# Altium project CHILD_BOARD.PrjPcb (part 1 of 2)
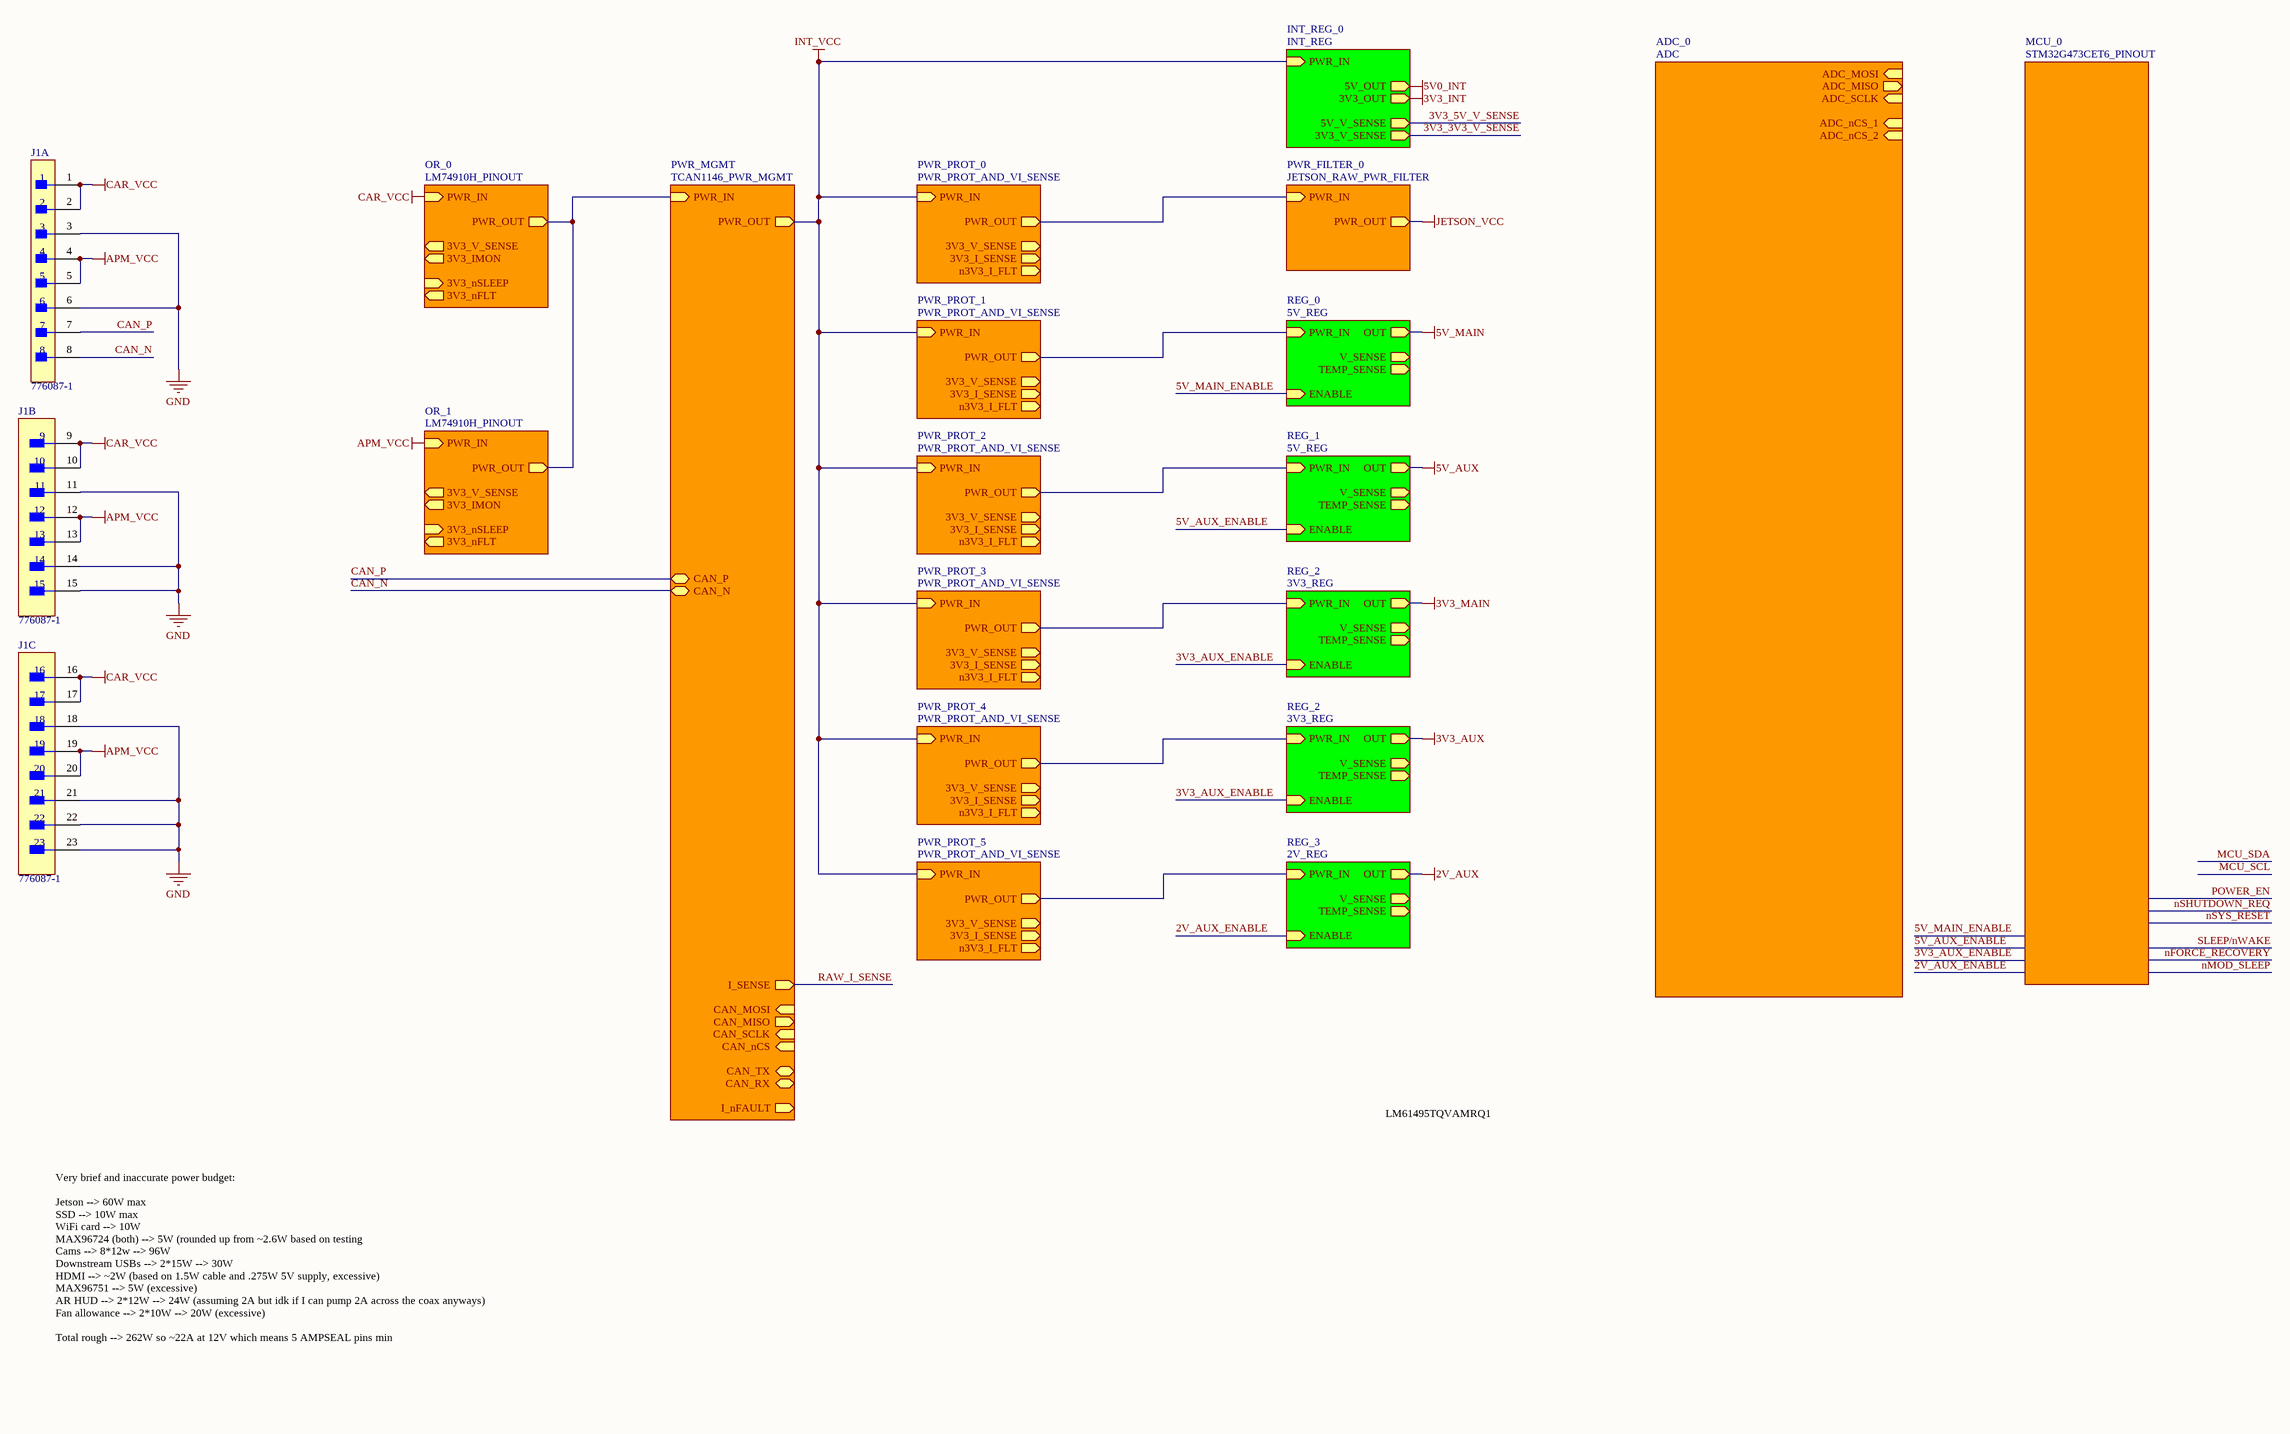
[diagram p0: CHILD_BOARD.SchDoc]
10 sheets, 204 parts. Net scope: hierarchical (ports join the sheet entries above them; power ports are global).
Board file: CHILD_BOARD_revA.PcbDoc
Sheets:
  CHILD_BOARD.SchDoc
    PWR_MGMT = TCAN1146_PWR_MGMT.SchDoc
    OR_0 = LM74910H_PINOUT.SchDoc
    OR_1 = LM74910H_PINOUT.SchDoc
    PWR_PROT_0 = PWR_PROT_AND_VI_SENSE.SchDoc
    REG_0 = 5V_REG.SchDoc
    REG_1 = 5V_REG.SchDoc
    PWR_FILTER_0 = JETSON_RAW_PWR_FILTER.SchDoc
    REG_3 = 2V_REG.SchDoc
    INT_REG_0 = INT_REG.SchDoc
    PWR_PROT_1 = PWR_PROT_AND_VI_SENSE.SchDoc
    PWR_PROT_2 = PWR_PROT_AND_VI_SENSE.SchDoc
    PWR_PROT_3 = PWR_PROT_AND_VI_SENSE.SchDoc
    PWR_PROT_4 = PWR_PROT_AND_VI_SENSE.SchDoc
    PWR_PROT_5 = PWR_PROT_AND_VI_SENSE.SchDoc
    ADC_0 = ADC.SchDoc
  PWR_MGMT.SchDoc

## Sheet CHILD_BOARD.SchDoc
size D; SheetNumber: 1; SheetTotal: 11

### Parts
J1  776087-1  [FP-776087-1-MFG]  (parts A,B,C of 3)

### Sub-sheets
ADC_0 = ADC: ADC_SCLK (in), ADC_MISO (out), ADC_MOSI (in), ADC_nCS_1 (in), ADC_nCS_2 (in)
INT_REG_0 = INT_REG: PWR_IN (in), 5V_OUT (out), 3V3_OUT (out), 5V_V_SENSE (out), 3V3_V_SENSE (out)
MCU_0 = STM32G473CET6_PINOUT (file not in this document): no entries
OR_0 = LM74910H_PINOUT: PWR_IN (in), PWR_OUT (out), 3V3_nFLT (out), 3V3_nSLEEP (in), 3V3_IMON (out), 3V3_V_SENSE (out)
OR_1 = LM74910H_PINOUT: PWR_IN (in), PWR_OUT (out), 3V3_nFLT (out), 3V3_nSLEEP (in), 3V3_IMON (out), 3V3_V_SENSE (out)
PWR_FILTER_0 = JETSON_RAW_PWR_FILTER: PWR_IN (in), PWR_OUT (out)
PWR_MGMT = TCAN1146_PWR_MGMT: PWR_IN (in), PWR_OUT (out), CAN_MOSI (in), CAN_MISO (out), CAN_SCLK (in), CAN_nCS (in), CAN_TX (bidir), CAN_RX (bidir), I_SENSE (out), I_nFAULT (out), CAN_P (bidir), CAN_N (bidir)
PWR_PROT_0 = PWR_PROT_AND_VI_SENSE: PWR_IN (in), PWR_OUT (out), 3V3_V_SENSE (out), 3V3_I_SENSE (out), n3V3_I_FLT (out)
PWR_PROT_1 = PWR_PROT_AND_VI_SENSE: PWR_IN (in), PWR_OUT (out), 3V3_V_SENSE (out), 3V3_I_SENSE (out), n3V3_I_FLT (out)
PWR_PROT_2 = PWR_PROT_AND_VI_SENSE: PWR_IN (in), PWR_OUT (out), 3V3_V_SENSE (out), 3V3_I_SENSE (out), n3V3_I_FLT (out)
PWR_PROT_3 = PWR_PROT_AND_VI_SENSE: PWR_IN (in), PWR_OUT (out), 3V3_V_SENSE (out), 3V3_I_SENSE (out), n3V3_I_FLT (out)
PWR_PROT_4 = PWR_PROT_AND_VI_SENSE: PWR_IN (in), PWR_OUT (out), 3V3_V_SENSE (out), 3V3_I_SENSE (out), n3V3_I_FLT (out)
PWR_PROT_5 = PWR_PROT_AND_VI_SENSE: PWR_IN (in), PWR_OUT (out), 3V3_V_SENSE (out), 3V3_I_SENSE (out), n3V3_I_FLT (out)
REG_0 = 5V_REG: PWR_IN (in), OUT (out), V_SENSE (out), ENABLE (in), TEMP_SENSE (out)
REG_1 = 5V_REG: OUT (out), PWR_IN (in), ENABLE (in), V_SENSE (out), TEMP_SENSE (out)
REG_2 = 3V3_REG (file not in this document): PWR_IN (in), OUT (out), V_SENSE (out), ENABLE (in), TEMP_SENSE (out)
REG_2 = 3V3_REG (file not in this document): PWR_IN (in), OUT (out), V_SENSE (out), ENABLE (in), TEMP_SENSE (out)
REG_3 = 2V_REG: PWR_IN (in), OUT (out), V_SENSE (out), ENABLE (in), TEMP_SENSE (out)

### Nets
3V3_MAIN: sheet REG_2/OUT
APM_VCC: J1.4 J1.5 J1.12 J1.13 J1.19 J1.20 ; sheet OR_1/PWR_IN
CAR_VCC: J1.1 J1.2 J1.9 J1.10 J1.16 J1.17 ; sheet OR_0/PWR_IN
GND: J1.3 J1.6 J1.11 J1.14 J1.15 J1.18 J1.21 J1.22 J1.23
INT_VCC: sheet PWR_MGMT/PWR_OUT, sheet PWR_PROT_0/PWR_IN, sheet INT_REG_0/PWR_IN, sheet PWR_PROT_1/PWR_IN, sheet PWR_PROT_2/PWR_IN, sheet PWR_PROT_3/PWR_IN, sheet PWR_PROT_4/PWR_IN, sheet PWR_PROT_5/PWR_IN  [project net PWR_OUT]
3V3_AUX_ENABLE: sheet REG_2/ENABLE, sheet REG_2/ENABLE
CAN_N: J1.8 ; sheet PWR_MGMT/CAN_N
CAN_P: J1.7 ; sheet PWR_MGMT/CAN_P
PWR_IN: sheet PWR_MGMT/PWR_IN, sheet OR_0/PWR_OUT, sheet OR_1/PWR_OUT
PWR_IN: sheet REG_0/PWR_IN, sheet PWR_PROT_1/PWR_OUT  [a separate net that carries the same name]
PWR_IN: sheet REG_1/PWR_IN, sheet PWR_PROT_2/PWR_OUT  [a separate net that carries the same name]
PWR_IN: sheet REG_3/PWR_IN, sheet PWR_PROT_5/PWR_OUT  [a separate net that carries the same name]
NetC?#1_1: sheet PWR_PROT_0/PWR_OUT, sheet PWR_FILTER_0/PWR_IN
NetR?_PWR_PROT_3#3_2: sheet REG_2/PWR_IN, sheet PWR_PROT_3/PWR_OUT
NetR?_PWR_PROT_4#3_2: sheet REG_2/PWR_IN, sheet PWR_PROT_4/PWR_OUT

### Notes on the sheet
- LM61495TQVAMRQ1
- Very brief and inaccurate power budget:
  Jetson --> 60W max
  SSD --> 10W max
  WiFi card --> 10W
  MAX96724 (both) --> 5W (rounded up from ~2.6W based on testing
  Cams --> 8*12w --> 96W
  Downstream USBs --> 2*15W --> 30W
  HDMI --> ~2W (based on 1.5W cable and .275W 5V supply, excessive)
  MAX96751 --> 5W (excessive)
  AR HUD --> 2*12W --> 24W (assuming 2A but idk if I can pump 2A across the coax anyways)
  Fan allowance --> 2*10W --> 20W (excessive)
  Total rough --> 262W so ~22A at 12V which means 5 AMPSEAL pins min

### Library data of the parts
J1 = CMP-03369-000157-2: CONN HEADER R/A 23POS 4MM; Max Voltage Rating (AC): 250V; PCB Thickness: 0.062inch; PCB Mount Alignment: Yes (With); Primary Type: Rectangular; Number of Signal Positions: 23; Row Spacing: 0.157inch; Current Rating: 17A; Connector System: Wire-to-Device; Number of Ports: 1; Shielding: Unshielded; PCB Mount Retention: With; Circuit Application: Power; Tab Thickness: 1.3mm; Gender: Male; Contact Shape: Circular; Mount: Through Hole; ELV: Compliant; Orientation: Right Angle; Lead Free: Lead Free; Contact Plating: Tin; Package Quantity: 1; RoHS Compliant: Yes; Connector Type: Header; Series: Ampseal; Termination: Solder; Voltage Rating (AC): 250V; Contact Material: Brass; Number of Rows: 3; Depth: 37.9mm; Housing Material: Polybutylene; Fastening Type: Ramp; Width: 37.9mm; Flammability Rating: UL94 V-0; Housing Color: Black; Radiation Hardening: No; Contact Type: Male Pin; Sealable: Yes (With); Length: 60.8mm; Max Operating Temperature: 221°C; Packaging: Bulk; Number of Positions: 23; Insulation Material: PBT; Pitch: 0.157inch; Contact Finish - Mating: TIN; Color: Black; Number of Terminals/Pins: 23; Insulation Color: Black; Number of Contacts: 23; Min Operating Temperature: -40°C

## Sheet TCAN1146_PWR_MGMT.SchDoc
size C; SheetNumber: 10; SheetTotal: 12
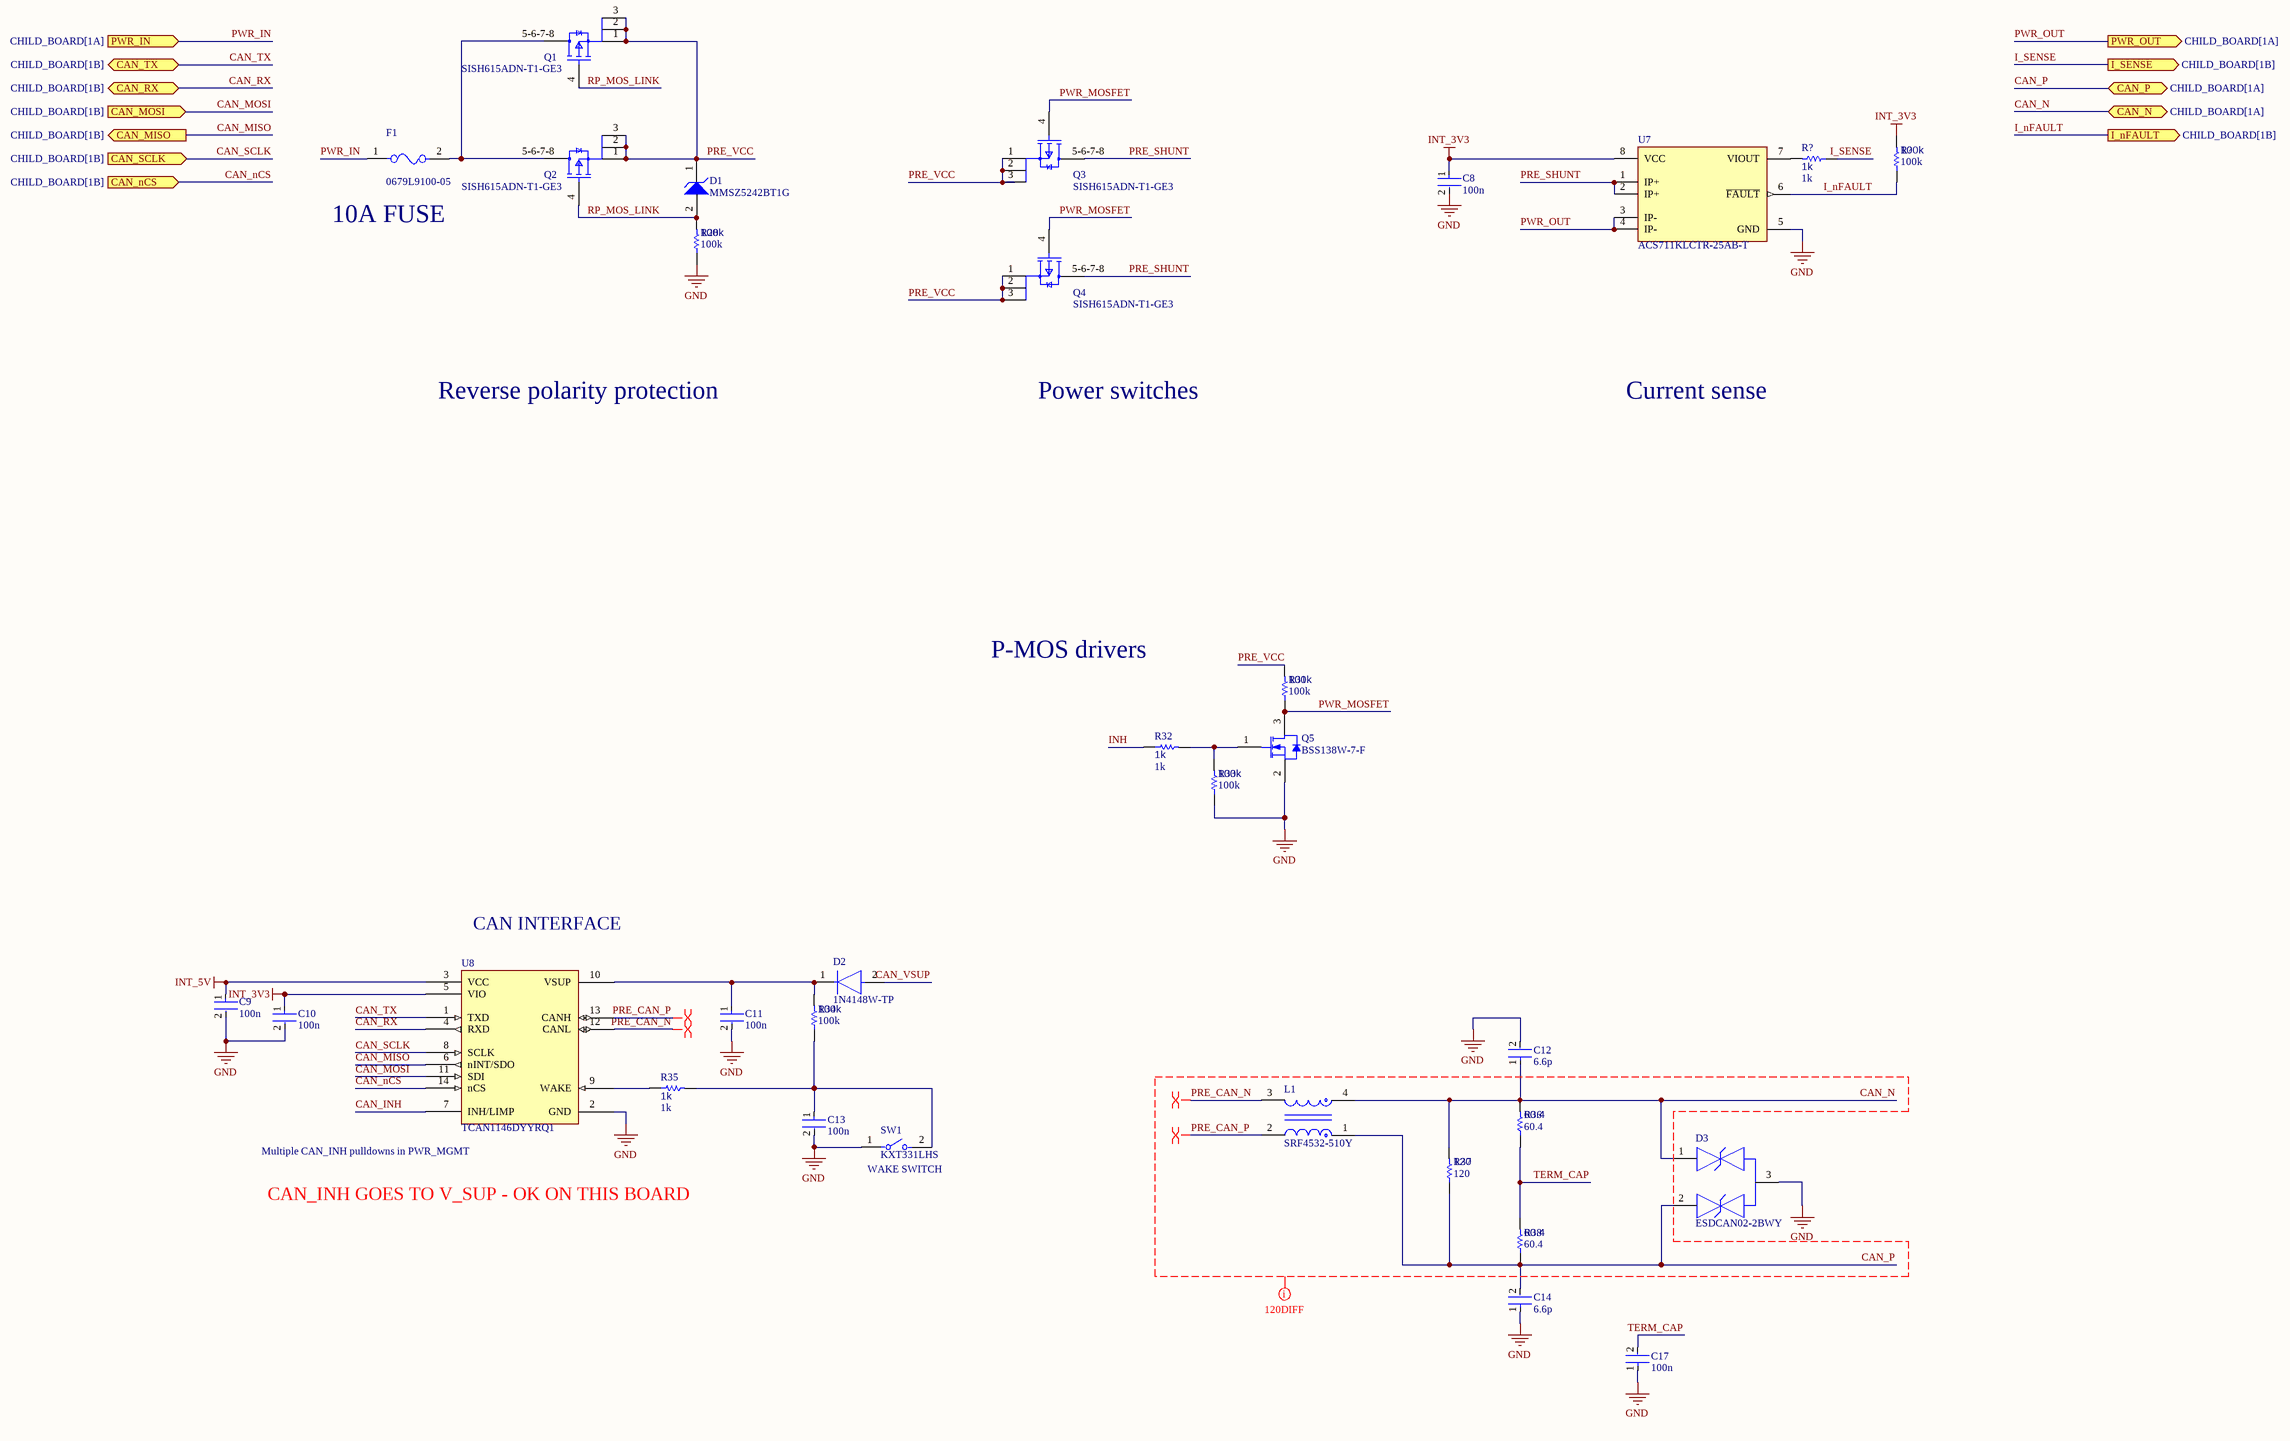
[diagram p1: TCAN1146_PWR_MGMT.SchDoc]

### Parts
(Parts that share a designator on the sheet are numbered #1, #2 ... from top to bottom, then left to right.)
C8  100n  [FP-0402-L_1_0_0_05-W_0_5-IPC_A]
C9  100n  [FP-0402-L_1_0_0_05-W_0_5-IPC_A]
C10  100n  [FP-0402-L_1_0_0_05-W_0_5-IPC_A]
C11  100n  [FP-0402-L_1_0_0_05-W_0_5-IPC_A]
C12  6.6p  [FP-0402-L_1_0_0_05-W_0_5-IPC_A]
C13  100n  [FP-0402-L_1_0_0_05-W_0_5-IPC_A]
C14  6.6p  [FP-0402-L_1_0_0_05-W_0_5-IPC_A]
C17  100n  [FP-0402-L_1_0_0_05-W_0_5-IPC_A]
D1  MMSZ5242BT1G  [ONSC-SOD-123-2-425-04_V]
D2  1N4148W-TP  [FP-SOD-123-IPC_A]
D3  ESDCAN02-2BWY  [FP-SOT323-3L-MFG]
F1  0679L9100-05  [FP-0679L-MFG]
L1  SRF4532-510Y  [FP-SRF4532-MFG]
Q1  SISH615ADN-T1-GE3  [SISH615ADN-T1-GE3-Footprint-1]
Q2  SISH615ADN-T1-GE3  [SISH615ADN-T1-GE3-Footprint-1]
Q3  SISH615ADN-T1-GE3  [SISH615ADN-T1-GE3-Footprint-1]
Q4  SISH615ADN-T1-GE3  [SISH615ADN-T1-GE3-Footprint-1]
Q5  BSS138W-7-F  [DIOD-SOT323-3_V]
R28  100k  [R0603B]
R31  100k  [R0603B]
R32  1k  [R0603B]
R33  100k  [R0603B]
R34  100k  [R0603B]
R35  1k  [R0603B]
R36  60.4  [R0603B]
R37  120  [R0603B]
R38  60.4  [R0603B]
R?#1  1k  [R0603B]
R?#2  100k  [R0603B]
SW1  KXT331LHS  [FP-KXT331LHS-MFG]
U7  ACS711KLCTR-25AB-T  [FP-LC-8-IPC_A]
U8  TCAN1146DYYRQ1  [TCAN1146DYYRQ1-Footprint-1]

### Ports
CAN_MISO (out, see CHILD_BOARD[1B]), CAN_MOSI (in, see CHILD_BOARD[1B]), CAN_N (bidir, see CHILD_BOARD[1A]), CAN_nCS (in, see CHILD_BOARD[1B]), CAN_P (bidir, see CHILD_BOARD[1A]), CAN_RX (bidir, see CHILD_BOARD[1B]), CAN_SCLK (in, see CHILD_BOARD[1B]), CAN_TX (bidir, see CHILD_BOARD[1B]), I_nFAULT (out, see CHILD_BOARD[1B]), I_SENSE (out, see CHILD_BOARD[1B]), PWR_IN (in, see CHILD_BOARD[1A]), PWR_OUT (out, see CHILD_BOARD[1A])

### Nets
GND: C8.2 C9.2 C10.2 C11.2 C12.2 C13.2 C14.1 C17.1 D3.3 Q5.2(S) R28.1 R33.1 SW1.1 U7.5(GND) U8.2(GND)
INT_3V3: C8.1 C10.1 R?#2.2 U7.8(VCC) U8.5(VIO)
INT_5V: C9.1 U8.3(VCC)
PWR_OUT: U7.3(IP-) U7.4(IP-) ; port PWR_OUT
CAN_INH: U8.7(INH/LIMP)
CAN_MISO: U8.6(nINT/SDO) ; port CAN_MISO
CAN_MOSI: U8.11(SDI) ; port CAN_MOSI
CAN_N: C12.1 D3.1 L1.4 R36.2 R37.2 ; port CAN_N
CAN_nCS: U8.14(nCS) ; port CAN_nCS
CAN_P: C14.2 D3.2 L1.1 R37.1 R38.1 ; port CAN_P
CAN_RX: U8.4(RXD) ; port CAN_RX
CAN_SCLK: U8.8(SCLK) ; port CAN_SCLK
CAN_TX: U8.1(TXD) ; port CAN_TX
CAN_VSUP: D2.2(A)
I_nFAULT: R?#2.1 U7.6(~{FAULT}) ; port I_nFAULT
I_SENSE: R?#1.1 ; port I_SENSE
INH: R32.1
PRE_CAN_N: L1.3 U8.12(CANL)
PRE_CAN_P: L1.2 U8.13(CANH)
PRE_SHUNT: Q3.5-6-7-8(D) Q4.5-6-7-8(D) U7.1(IP+) U7.2(IP+)
PRE_VCC: D1.1(K) Q1.1(S) Q1.2(S) Q1.3(S) Q2.1(S) Q2.2(S) Q2.3(S) Q3.1(S) Q3.2(S) Q3.3(S) Q4.1(S) Q4.2(S) Q4.3(S) R31.2
PWR_IN: F1.1 ; port PWR_IN
PWR_MOSFET: Q3.4(G) Q4.4(G) Q5.3(D) R31.1
RP_MOS_LINK: D1.2(A) Q1.4(G) Q2.4(G) R28.2
TERM_CAP: C17.2 R36.1 R38.2
NetC11_1: C11.1 D2.1(C) R34.2 U8.10(VSUP)
NetC13_1: C13.1 R34.1 R35.2 SW1.2
NetF1_2: F1.2 Q1.5-6-7-8(D) Q2.5-6-7-8(D)
NetQ5_1: Q5.1(G) R32.2 R33.2
NetR35_1: R35.1 U8.9(WAKE)
NetR?#1_2: R?#1.2 U7.7(VIOUT)

### Layout directives
differential pair: PRE_CAN_N, PRE_CAN_P
net class 120DIFF: CAN_N, CAN_P, PRE_CAN_N, PRE_CAN_P, TERM_CAP

### Notes on the sheet
- (near F1) 10A FUSE
- Reverse polarity protection
- Power switches
- Current sense
- P-MOS drivers
- CAN INTERFACE
- (near U8) Multiple CAN_INH pulldowns in PWR_MGMT
- (near SW1) WAKE SWITCH
- CAN_INH GOES TO V_SUP - OK ON THIS BOARD

### Library data of the parts
C8-C14 C17 = CMP-001-00058-1: LARGE PADS, 0402 CAP, CHANGE COMMENT TO MATCH REAL P/N; Capacitor Type: Ceramic; Min Operating Temperature: -55°C; Mounting Technology: Surface Mount; Pins: 2; Case/Package: 0402; RoHS Compliant: Yes; Max Operating Temperature: 85°C
D1 = CMP-1060-00565-1: Zener Voltage Regulator, 500 mW, 2-Pin SOD-123, Pb-Free, Tape and Reel; Manufacturer: On Semiconductor; P Max (W): 0.5; VZ Typ (V): 12; PartNumber: MMSZ5242BT1G; PackageReference: SOD-123-2-425-04; ComponentLink3URL: http://www.onsemi.com/pub_link/Collateral/425-04.PDF; Mounting Technology: Surface Mount; ComponentLink2Description: Datasheet; ComponentLink1URL: http://www.onsemi.com/; ComponentLink3Description: Package Specification; PackageDescription: 2-Pin SOD, Body 1.6 x 2.69 mm; PackageVersion: Rev. G, 10/2009; ComponentLink1Description: Manufacturer URL; RoHS: Pb-Free; ComponentLink2URL: http://www.onsemi.com/pub_link/Collateral/MMSZ5221BT1-D.PDF; Packing: Tape and Reel; DatasheetVersion: Rev. 12
D2 = CMP-2000-04993-2: DIODE GEN PURP 100V 150MA SOD123; Max Reverse Leakage Current: 5uA; Max Surge Current: 2A; Reverse Recovery Time: 4ns; Polarity: Standard; Capacitance: 4pF; Max Forward Surge Current (Ifsm): 1A; Element Configuration: Single; Power Dissipation: 400mW; Forward Voltage: 1V; Radiation Hardening: No; Lead Free: Lead Free; Max Reverse Voltage (DC): 100V; Current Rating: 150mA; Forward Current: 150mA; Packaging: Tape and Reel; Number of Pins: 2; Package Quantity: 3000; Max Operating Temperature: 150°C; Min Operating Temperature: -65°C; Average Rectified Current: 150mA; Recovery Time: 4ns; Output Current: 150mA; Peak Non-Repetitive Surge Current: 2A; Width: 1.8mm; Voltage Rating (DC): 100V; Height: 1.2mm; Max Repetitive Reverse Voltage (Vrrm): 100V; Mount: Surface Mount; Length: 2.85mm
D3 = CMP-12225-000055-1: TVS DIODE 26.5V 44V SOT323-3; Manufacturer: STMicroelectronics; Value: 3pF; Direction: Bidirectional; Breakdown Voltage: 28.5V; Automotive Grade: Grade 0; Standoff Height: 0mm; Peak Pulse Power: 170W; Peak Pulse Current: 3A; Number Of Channels: 2; Max Junction Temp: +175°C; Mouser Description: TVS Diodes / ESD Suppressors Automotive dual-line Transil, Transient voltage suppressor (TVS) for CAN bus; Height: 1.1mm; Category: Diode; Reverse Standoff Voltage: 26.5V; Device Class L1: Circuit Protection; Temperature: -55°C to +175°C; RoHS: TRUE; ComponentLink2URL: https://www.st.com/resource/en/datasheet/esdcan02-2bwy.pdf; Device Class L3: unset; Device Class L2: TVS Diodes; Temperature Range High: +175°C; Octopart: https://octopart.com/esdcan02-2bwy-stmicroelectronics-58631133; Ipc Land Pattern Name: SOT65P210X95-3; Temperature Range Low: -55°C; Capacitance: 3pF; Digikey Description: TVS DIODE 26.5V 44V SOT323-3; Automotive: Yes; ComponentLink2Description: Datasheet; Clamping Voltage: 44V; Manufacturer Part Number: ESDCAN02-2BWY; Lead Free: Yes; Package: SOT323-3L
F1 = CMP-16042-000002-1: DIFF P#!!! / FUSE BRD MNT 10A 125VAC/VDC; Manufacturer: Bel Fuse; Manufacturer Part Number: 0679L9150-01; Max Fuse Ac Voltage: 125V; Fuse Blow Speed: Fast; Fuse Current: 15A; Fuse I2T: 103.5A2Sec; Fuse Interrupt Ac Current: 50A; Automotive Grade: Grade 1; Value: 0.0038Ω; Fuse Interrupt Dc Current: 300A; Fuse Voltage Drop: 0.13V; Device Class L2: Fuses; ComponentLink2URL: https://www.belfuse.com/resources/CircuitProtection/datasheets/0679L%20Sep2016.pdf; Package: 0679L; Height: 2.79mm; Digikey Description: FUSE BRD MNT 15A 125VAC/VDC; Temperature Range High: +125°C; Device Class L3: unset; Octopart: https://octopart.com/0679l9150-01-bel+fuse-70850665; Temperature Range Low: -55°C; Max Fuse Dc Voltage: 125V; Ipc Land Pattern Name: CAPC610254X254; Category: Fuse; Lead Free: Yes; Automotive: Yes; Resistance: 0.0038Ω; RoHS: TRUE; Device Class L1: Circuit Protection; ComponentLink2Description: Datasheet; Temperature: -55°C to +125°C; Voltage Rating: 125V
L1 = CMP-07251-000006-1: CMC 51UH 200MA 2LN 2KOHM SMD; Element Configuration: Dual; Number of Lines: 2; Core Material: Ferrite; Impedance: 2kR; Test Frequency: 100kHz; Voltage Rating (DC): 50V; Insulation Resistance: 10MR; Material: Steel; Tolerance: 50%; DC Resistance (DCR): 3.5R; RoHS Compliant: Yes; Mount: Surface Mount; REACH SVHC: No SVHC; Termination: SMD/SMT; DC Current: 200mA; Current: 200mA; Lead Free: Lead Free; Contact Plating: Tin; Length: 4.5mm; Max DC Current: 200mA; Width: 0.126inch; Case/Package: 4532; Packaging: Tape and Reel; Package Quantity: 1; Min Operating Temperature: -40°C; Depth: 3.4mm; Series: SRF4532; Max Operating Temperature: 125°C; Current Rating: 200mA; Self Resonant Frequency: 100kHz; Height: 0.118inch; Inductance: 51uH; Resistance: 2kR
Q1-Q4 = CMP-013-00018-2: Trans MOSFET P-CH 20V 22.1A 8-Pin PowerPAK 1212 EP T/R; Source: SISH615ADN-T1-GE3.SchLib; Design Item ID: CMP-013-00036-4; Component Type: Standard; Pins: 5
Q5 = CMP-2000-05968-1: N-Channel Enhancement Mode Mosfet, 50 V, 200 mA, -55 to 150 degC, 6-Pin SOT-323, RoHS, Tape and Reel; Typical Turn-Off Delay Time: 20ns; Number of Channels: 1Channel; Type: EnhancementModeFieldEffectTransistor; Brand: DiodesIncorporated; Vds - Drain-Source Breakdown Voltage: 75V; Vgs - Gate-Source Voltage: 20V; Rds On - Drain-Source Resistance: 1.4Ohms; Transistor Type: 1N-Channel; Configuration: Single; Unit Weight: 0.000212oz; Pd - Power Dissipation: 200mW; Id - Continuous Drain Current: 200mA; Forward Transconductance - Min: 0.1S; Manufacturer URL: http://www.diodes.com/; Series: BSS138; Package Description: 3-Pin Small Outline Transistor, Body 2 x 1.25 mm, Pitch 0.65 mm; Mounting Technology: SurfaceMount; Product Category: MOSFET; RoHS: True; Maximum Operating Temperature: +150C; Height: 1mm; Length: 2.2mm; Technology: Si; Width: 1.35mm; Datasheet URL: http://www.diodes.com/_files/datasheets/ds30206.pdf; Manufacturer: DiodesIncorporated; Package / Case: SOT-323-3; Typical Turn-On Delay Time: 20ns; Transistor Polarity: N-Channel; Factory Pack Quantity: 3000; Packaging: Reel; Product: MOSFETSmallSignal; Datasheet Version: Rev. 11-2, 09/2013; Package Reference: SOT323; Minimum Operating Temperature: -55C; Mounting Style: SMD/SMT; Channel Mode: Enhancement
R28 R31-R38 R?#1 R?#2 = CMP-009-00002-14: Resistor
  R28 R31 R33 R34 R?#2: Value: 100k
  R32 R35 R?#1: Value: 1k
  R36 R38: Value: 60.4
  R37: Value: 120
SW1 = CMP-10040-000029-1: SWITCH TACTILE SPST-NO 0.02A 15V; Operating Force: 240gf; Switch Travel: 0.13mm; Illumination Type: Non-Illuminated; Throw Configuration: SPST; Number of Ports: 1; Current Rating: 5A; Mechanical Life: 500000Cycles; Switch Function: Off-Mom; Connector Type: USB; Actuator Type: Standard; Gender: Receptacle; Number of Contacts: 24; Contact Plating: Gold; Insulation Color: Black; Min Operating Temperature: -40°C; Packaging: Tape and Reel; Flammability Rating: UL94 V-0; Max Operating Temperature: 85°C; Termination: Solder; Mount: Surface Mount
U7 = CMP-1557-00015-2: SENSOR CURRENT HALL 25A AC/DC; Bandwidth: 100kHz; Min Supply Voltage: 3V; Polarity: Bidirectional; Max Supply Voltage: 5.5V; Max Supply Current: 5.5mA; Number of Channels: 1; Quiescent Current: 4mA; Sensitivity: 55mV/A; Accuracy: 4%; Linearity: 1%; Operating Supply Voltage: 3.3V; Response Time: 4.6us; Case/Package: SOIC; Min Operating Temperature: -40°C; RoHS Compliant: Yes; Length: 4.9mm; Package Quantity: 1; Number of Pins: 8; Width: 3.9mm; REACH SVHC: No SVHC; -3db Bandwidth: 100kHz; Series: -; Packaging: Tape and Reel; Max Operating Temperature: 125°C; Current Sensing: 25A; Height: 1.5mm; Frequency: 100kHz
U8 = CMP-318-000000-2: Automotive CAN FD transceiver with watchdog, bus diagnostics and partial networking via sele 14-SOT-23-THIN -40 to 150; Component Type: Standard; Design Item ID: CMP-015-00012-2; Pin Count: 14; Source: TCAN1146DYYRQ1.SchLib

## Sheet LM74910H_PINOUT.SchDoc
size C; SheetNumber: 10; SheetTotal: 12
Used 2 times, as channels OR_0, OR_1. Parts and nets are listed once, with the designators drawn on the sheet.
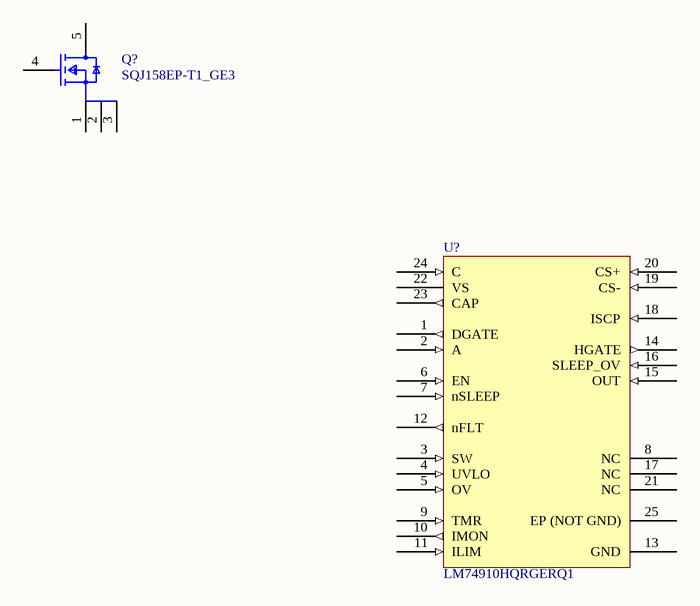
[diagram p2: LM74910H_PINOUT.SchDoc]

### Parts
Q?  SQJ158EP-T1_GE3  [FP-T16-0221-SINGLE-MFG]
U?  LM74910HQRGERQ1  [QFN50P400X400X100_HS-25N]

### Nets

Not connected (* = marked no-connect by the designer): Q? 1(S) 2(S) 3(S) 4(G) 5(D); U? 1(DGATE) 2(A) 3(SW) 4(UVLO) 5(OV) 6(EN) 7(nSLEEP) 8(NC) 9(TMR) 10(IMON) 11(ILIM) 12(nFLT) 13(GND) 14(HGATE) 15(OUT) 16(SLEEP_OV) 17(NC) 18(ISCP) 19(CS-) 20(CS+) 21(NC) 22(VS) 23(CAP) 24(C) 25(EP_(NOT_GND))

### Channels
OR_0: designators end in _OR_0
OR_1: designators end in _OR_1

### Library data of the parts
Q? = CMP-02550-000155-1: MOSFET N-CH 60V 23A POWERPAKSO-8; Manufacturer: Vishay; Input Capacitace At Vds: 810pF @ 25V; Standoff Height: 0mm; Number Of N Channels: 1; Reverse Recovery Charge: 25nC; Power Dissipation: 45W; Pulse Drain Current: 80A; Turn Off Delay Time: 22ns; Typ Forward Diode Voltage: 0.83V; Threshold Vgs Max: 2.5V; Gate Charge At Vgs: 17nC @ 10V; Automotive Grade: Grade 0; Drain To Source Resistance: 0.0272Ω; Max Junction Temp: +175°C; Gate To Source Voltage: 20V; Threshold Vgs Min: 1.5V; Max Forward Diode Voltage: 1.2V; Turn On Delay Time: 10ns; Rthja Max: 70°C/W; Transconductance: 36S; Depletion Mode: False; Reverse Recovery Time: 25ns; Drain To Source Breakdown Voltage: 60V; RoHS: TRUE; Footprint Url: http://www.vishay.com/docs/63818/ppso8ls.pdf; Digikey Description: MOSFET N-CH 60V 23A POWERPAKSO-8; Temperature Range Low: -55°C; Temperature Range High: +175°C; Package: T16-0221-SINGLE; Height: 1.267mm; ComponentLink2URL: http://www.vishay.com/docs/75249/sqj158ep.pdf; ComponentLink2Description: Datasheet; Automotive: Yes; Device Class L2: Transistors; Continuous Drain Current: 23A; Device Class L1: Discrete Semiconductors; Device Class L3: MOSFETs; Category: Trans; Octopart: https://octopart.com/sqj158ep-t1_ge3-vishay-78440606; Drain To Source Voltage: 60V; Lead Free: Yes; Temperature: -55°C to +175°C; Number Of Channels: 1; Manufacturer Part Number: SQJ158EP-T1_GE3
U? = CMP-019-00057-1: Automotive ideal diode with circuit breaker, 200-kHz ACS, UV , OV protection and SLEEP mode 24-VQFN -40 to 125; Pins: 24; Case/Package: VQFN

## Sheet PWR_PROT_AND_VI_SENSE.SchDoc
size A; SheetNumber: 11; SheetTotal: 12
Used 6 times, as channels PWR_PROT_0, PWR_PROT_1, PWR_PROT_2, PWR_PROT_3, PWR_PROT_4, PWR_PROT_5. Parts and nets are listed once, with the designators drawn on the sheet.
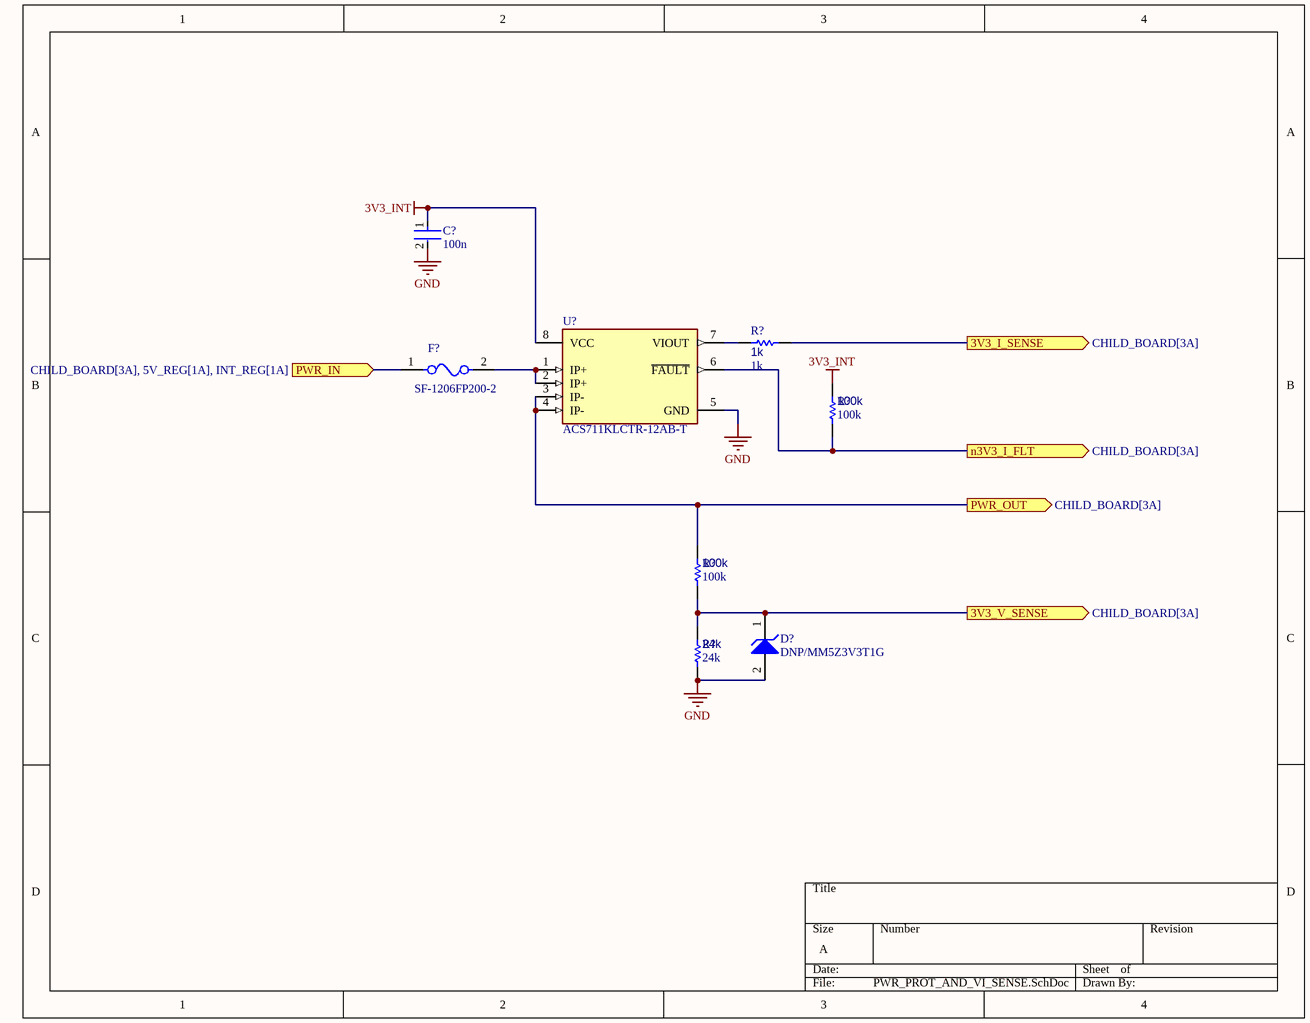
[diagram p3: PWR_PROT_AND_VI_SENSE.SchDoc]

### Parts
(Parts that share a designator on the sheet are numbered #1, #2 ... from top to bottom, then left to right.)
C?  100n  [FP-0402-L_1_0_0_05-W_0_5-IPC_A]
D?  DNP/MM5Z3V3T1G  [ONSC-SOD-523-2-502-01_V]
F?  SF-1206FP200-2  [FP-SF-1206FP-MFG]
R?#1  1k  [R0603B]
R?#2  100k  [R0603B]
R?#3  100k  [R0603B]
R?#4  24k  [R0603B]
U?  ACS711KLCTR-12AB-T  [FP-LC-8-IPC_C]

### Ports
3V3_I_SENSE (out, see CHILD_BOARD[3A]), 3V3_V_SENSE (out, see CHILD_BOARD[3A]), n3V3_I_FLT (out, see CHILD_BOARD[3A]), PWR_IN (in, see CHILD_BOARD[3A], 5V_REG[1A], INT_REG[1A]), PWR_OUT (out, see CHILD_BOARD[3A])

### Nets
3V3_INT: C?.1 R?#2.2 U?.8(VCC)
GND: C?.2 D?.2(A) R?#4.1 U?.5(GND)
3V3_I_SENSE: R?#1.2 ; port 3V3_I_SENSE
3V3_V_SENSE: D?.1(K) R?#3.1 R?#4.2 ; port 3V3_V_SENSE
n3V3_I_FLT: R?#2.1 U?.6(~{FAULT}) ; port n3V3_I_FLT
PWR_IN: F?.1 ; port PWR_IN
PWR_OUT: R?#3.2 U?.3(IP-) U?.4(IP-) ; port PWR_OUT
NetF?_2: F?.2 U?.1(IP+) U?.2(IP+)
NetR?#1_1: R?#1.1 U?.7(VIOUT)

### Channels
PWR_PROT_0: designators C?=C?_PWR_PROT_0 D?=D?_PWR_PROT_0 F?=F?_PWR_PROT_0 R?=R?_PWR_PROT_0#1 R?=R?_PWR_PROT_0#2 R?=R?_PWR_PROT_0#3 R?=R?_PWR_PROT_0#4 U?=U?_PWR_PROT_0; ports 3V3_I_SENSE=NetR?_PWR_PROT_0#1_2 3V3_V_SENSE=NetD?_PWR_PROT_0_1 n3V3_I_FLT=NetR?_PWR_PROT_0#2_1 PWR_IN=PWR_OUT PWR_OUT=NetC?#1_1
PWR_PROT_1: designators C?=C?_PWR_PROT_1 D?=D?_PWR_PROT_1 F?=F?_PWR_PROT_1 R?=R?_PWR_PROT_1#1 R?=R?_PWR_PROT_1#2 R?=R?_PWR_PROT_1#3 R?=R?_PWR_PROT_1#4 U?=U?_PWR_PROT_1; ports 3V3_I_SENSE=NetR?_PWR_PROT_1#1_2 3V3_V_SENSE=NetD?_PWR_PROT_1_1 n3V3_I_FLT=NetR?_PWR_PROT_1#2_1 PWR_IN=PWR_OUT PWR_OUT=PWR_IN
PWR_PROT_2: designators C?=C?_PWR_PROT_2 D?=D?_PWR_PROT_2 F?=F?_PWR_PROT_2 R?=R?_PWR_PROT_2#1 R?=R?_PWR_PROT_2#2 R?=R?_PWR_PROT_2#3 R?=R?_PWR_PROT_2#4 U?=U?_PWR_PROT_2; ports 3V3_I_SENSE=NetR?_PWR_PROT_2#1_2 3V3_V_SENSE=NetD?_PWR_PROT_2_1 n3V3_I_FLT=NetR?_PWR_PROT_2#2_1 PWR_IN=PWR_OUT PWR_OUT=PWR_IN
PWR_PROT_3: designators C?=C?_PWR_PROT_3 D?=D?_PWR_PROT_3 F?=F?_PWR_PROT_3 R?=R?_PWR_PROT_3#1 R?=R?_PWR_PROT_3#2 R?=R?_PWR_PROT_3#3 R?=R?_PWR_PROT_3#4 U?=U?_PWR_PROT_3; ports 3V3_I_SENSE=NetR?_PWR_PROT_3#1_2 3V3_V_SENSE=NetD?_PWR_PROT_3_1 n3V3_I_FLT=NetR?_PWR_PROT_3#2_1 PWR_IN=PWR_OUT PWR_OUT=NetR?_PWR_PROT_3#3_2
PWR_PROT_4: designators C?=C?_PWR_PROT_4 D?=D?_PWR_PROT_4 F?=F?_PWR_PROT_4 R?=R?_PWR_PROT_4#1 R?=R?_PWR_PROT_4#2 R?=R?_PWR_PROT_4#3 R?=R?_PWR_PROT_4#4 U?=U?_PWR_PROT_4; ports 3V3_I_SENSE=NetR?_PWR_PROT_4#1_2 3V3_V_SENSE=NetD?_PWR_PROT_4_1 n3V3_I_FLT=NetR?_PWR_PROT_4#2_1 PWR_IN=PWR_OUT PWR_OUT=NetR?_PWR_PROT_4#3_2
PWR_PROT_5: designators C?=C?_PWR_PROT_5 D?=D?_PWR_PROT_5 F?=F?_PWR_PROT_5 R?=R?_PWR_PROT_5#1 R?=R?_PWR_PROT_5#2 R?=R?_PWR_PROT_5#3 R?=R?_PWR_PROT_5#4 U?=U?_PWR_PROT_5; ports 3V3_I_SENSE=NetR?_PWR_PROT_5#1_2 3V3_V_SENSE=NetD?_PWR_PROT_5_1 n3V3_I_FLT=NetR?_PWR_PROT_5#2_1 PWR_IN=PWR_OUT PWR_OUT=PWR_IN

### Library data of the parts
C? = CMP-001-00058-1: as C8 on sheet TCAN1146_PWR_MGMT; Min Operating Temperature: -55°C; Mounting Technology: Surface Mount; Pins: 2; Case/Package: 0402; RoHS Compliant: Yes; Max Operating Temperature: 85°C
D? = CMP-1060-00750-1: Zener Voltage Regulator, 500 mW, 2-Pin SOD-523, Pb-Free, Tape and Reel; Manufacturer: On Semiconductor; P Max (W): 0.5; VZ Typ (V): 3.3; RoHS: Pb-Free; ComponentLink2Description: Datasheet; PackageReference: SOD-523-2-502-01; DatasheetVersion: Rev. 10; ComponentLink1Description: Manufacturer URL; PackageVersion: Rev. E, 09/2010; ComponentLink3URL: http://www.onsemi.com/pub_link/Collateral/502-01.PDF; ComponentLink2URL: http://www.onsemi.cn/pub_link/Collateral/MM5Z2V4T1-D.PDF; Mounting Technology: Surface Mount; PartNumber: MM5Z3V3T1G; Packing: Tape and Reel; PackageDescription: 2-Pin SOD, Body 1.2 x 0.8 mm; ComponentLink1URL: http://www.onsemi.com/; ComponentLink3Description: Package Specification
F? = CMP-07399-000013-1: FUSE BOARD MOUNT 2A 63VDC 1206; Voltage Rating (DC): 63V; Fuse Type: Board Mount (Cartridge Style Excluded); Approvals: UL; Mount: Surface Mount; Min Operating Temperature: -20°C; Max Operating Temperature: 105°C; Case Code (Imperial): 1206; Packaging: Cut Tape; Current Rating: 2A; RoHS Compliant: Yes; Series: SinglFuse™ SF-1206FP; Case Code (Metric): 3216; Case/Package: 1206
R?#1-R?#4 = CMP-009-00002-14: Resistor
  R?#1: Value: 1k
  R?#2 R?#3: Value: 100k
  R?#4: Value: 24k
U? = CMP-1557-00012-2: SENSOR CURRENT HALL 12.5A AC/DC; Number of Channels: 1; Min Supply Voltage: 3V; Sensitivity: 110mV/A; Response Time: 4.6us; Operating Supply Voltage: 3.3V; Max Supply Voltage: 5.5V; Max Supply Current: 5.5mA; Bandwidth: 100kHz; Linearity: 1%; Quiescent Current: 4mA; Accuracy: 5%; Polarity: Bidirectional; Case/Package: SOIC; Packaging: Tape and Reel; Number of Pins: 8; Width: 3.9mm; Frequency: 100kHz; -3db Bandwidth: 100kHz; REACH SVHC: No SVHC; Series: -; Height: 1.5mm; Package Quantity: 1; Min Operating Temperature: -40°C; Max Operating Temperature: 125°C; Current Sensing: 12.5A; RoHS Compliant: Yes; Length: 4.9mm

## Sheet 5V_REG.SchDoc
size A4; SheetNumber: 4; SheetTotal: 11
Used 2 times, as channels REG_0, REG_1. Parts and nets are listed once, with the designators drawn on the sheet.
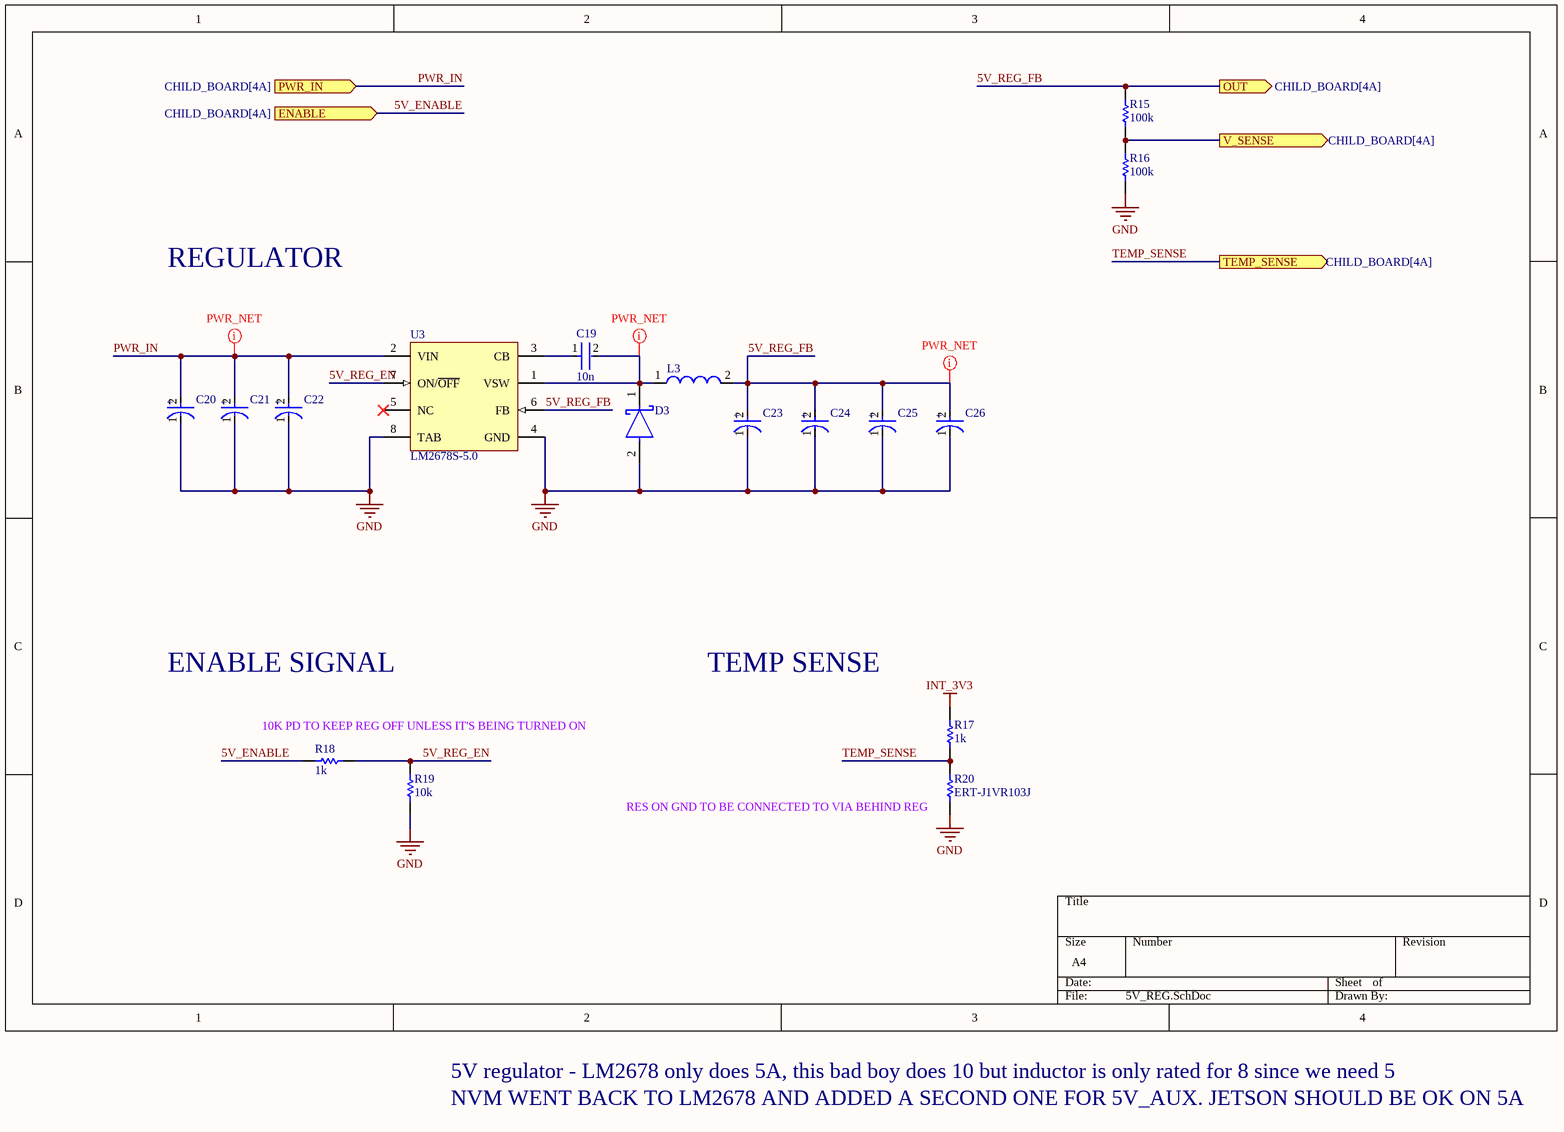
[diagram p4: 5V_REG.SchDoc]

### Parts
C19  10n  [FP-0402-L_1_0_0_05-W_0_5-IPC_A]
C20  20SVP33M  [FP-OS-CON-SMT-E7-MFG]  (value not drawn)
C21  20SVP33M  [FP-OS-CON-SMT-E7-MFG]  (value not drawn)
C22  20SVP33M  [FP-OS-CON-SMT-E7-MFG]  (value not drawn)
C23  EEE-1AA101WR  [FP-SC-MFG]  (value not drawn)
C24  EEE-1AA101WR  [FP-SC-MFG]  (value not drawn)
C25  EEE-1AA101WR  [FP-SC-MFG]  (value not drawn)
C26  EEE-1AA101WR  [FP-SC-MFG]  (value not drawn)
D3  B540C-13-F  [FP-SMC-MFG]  (value not drawn)
L3  74477110  [WE-PD-L]  (value not drawn)
R15  100k  [R0603B]
R16  100k  [R0603B]
R17  1k  [R0603B]
R18  1k  [R0603B]
R19  10k  [R0603B]
R20  ERT-J1VR103J  [RESC1608X90X30ML15T20]
U3  LM2678S-5.0  [KTW0007B_N]

### Ports
ENABLE (in, see CHILD_BOARD[4A]), OUT (out, see CHILD_BOARD[4A]), PWR_IN (in, see CHILD_BOARD[4A]), TEMP_SENSE (out, see CHILD_BOARD[4A]), V_SENSE (out, see CHILD_BOARD[4A])

### Nets
GND: C20.1(C) C21.1(C) C22.1(C) C23.1(C) C24.1(C) C25.1(C) C26.1(C) D3.2(A) R16.2 R19.2 R20.1 U3.4(GND) U3.8(TAB)
INT_3V3: R17.1
5V_ENABLE: R18.2 ; port ENABLE
5V_REG_EN: R18.1 R19.1 U3.7(ON/~{OFF})
5V_REG_FB: C23.2(A) C24.2(A) C25.2(A) C26.2(A) L3.2 R15.1 U3.6(FB) ; port OUT
PWR_IN: C20.2(A) C21.2(A) C22.2(A) U3.2(VIN) ; port PWR_IN
TEMP_SENSE: R17.2 R20.2 ; port TEMP_SENSE
V_SENSE: R15.2 R16.1 ; port V_SENSE
NetC19_1: C19.1 U3.3(CB)
NetC19_2: C19.2 D3.1(C) L3.1 U3.1(VSW)

Not connected (* = marked no-connect by the designer): U3 5(NC)*

### Channels
REG_0: designators end in _REG_0; ports ENABLE=5V_ENABLE_REG_0 OUT=5V_REG_FB_REG_0 PWR_IN=PWR_IN TEMP_SENSE=TEMP_SENSE_REG_0 V_SENSE=NetR15_REG_0_2
REG_1: designators end in _REG_1; ports ENABLE=5V_AUX_ENABLE OUT=5V_REG_FB_REG_1 PWR_IN=PWR_IN TEMP_SENSE=TEMP_SENSE_REG_1 V_SENSE=NetR15_REG_1_2

### Layout directives
net class PWR: 5V_REG_FB_REG_0, NetC19_REG_0_2, PWR_IN

### Notes on the sheet
- REGULATOR
- ENABLE SIGNAL
- TEMP SENSE
- 10K PD TO KEEP REG OFF UNLESS IT'S BEING TURNED ON
- RES ON GND TO BE CONNECTED TO VIA BEHIND REG
- 5V regulator - LM2678 only does 5A, this bad boy does 10 but inductor is only rated for 8 since we need 5
- NVM WENT BACK TO LM2678 AND ADDED A SECOND ONE FOR 5V_AUX. JETSON SHOULD BE OK ON 5A
- (in symbol CMP-05427-000047-1) +
- (in symbol CMP-05428-001387-1) +

### Library data of the parts
C19 = CMP-001-00058-1: as C8 on sheet TCAN1146_PWR_MGMT; Min Operating Temperature: -55°C; Mounting Technology: Surface Mount; Pins: 2; Case/Package: 0402; RoHS Compliant: Yes; Max Operating Temperature: 85°C
C20-C22 = CMP-05428-001387-1: Conductive Polymer Aluminum Solid Capacitors (OS-CON) 33uF ±20% 20V RADIAL SMT 8x6.9mm; Polarity: Polar; Life (Hours): 2000Hour; Leakage Current: 132uA; ESR (Equivalent Series Resistance): 45mR; Ripple Current (AC): 1.89A; Dissipation Factor: 12%; Construction: Cylindrical; Capacitance: 33uF; Max Operating Temperature: 105°C; Min Operating Temperature: -55°C; Voltage: 20V; Number of Pins: 7; Termination: SMD/SMT; Package Quantity: 1000; Packaging: Tape and Reel; REACH SVHC: No SVHC; Mount: Surface Mount; Tolerance: 20%; Voltage Rating (DC): 20V; Height: 6.9mm; Series: OS-CON™, SVP; Diameter: 8mm; Length: 6.9mm; Ripple Current: 1.89A; RoHS Compliant: Yes; Height - Seated (Max): 0.276inch; Case/Package: Radial; Voltage Rating: 20V
C23-C26 = CMP-05427-000047-1: CAP ALUM 100UF 20% 10V SMD; Life (Hours): 1000Hour; Ripple Current: 50mA; Packaging: Tape and Reel; Diameter: 5mm; Voltage Rating (DC): 10V; Mount: Surface Mount; Max Operating Temperature: 85°C; Length: 5.5mm; Case/Package: Radial; Height: 5.4mm; Construction: Cylindrical; Termination: SMD/SMT; Height - Seated (Max): 0.213inch; Series: S; Min Operating Temperature: -40°C; Capacitance: 100uF; Tolerance: 20%; Voltage Rating: 10V; Package Quantity: 1; Radiation Hardening: No; Ripple Current (AC): 50mA; Lead Free: Lead Free; RoHS Compliant: Yes; Contact Plating: Tin
D3 = CMP-2000-05097-3: DIODE SCHOTTKY 40V 5A SMC; Manufacturer: Diodes Inc.; Automotive Grade: NA; Peak Reverse Current: 0.5mA; Value: 300pF; Max Junction Temp: +150°C; Max Surge Forward Current: 100A; Standoff Height: 0.1mm; Digikey Description: DIODE SCHOTTKY 40V 5A SMC; Temperature Range Low: -55°C; Manufacturer Part Number: B540C-13-F; Octopart: https://octopart.com/b540c-13-f-diodes+inc.-325873; Lead Free: Yes; Reverse Voltage: 40V; RoHS: TRUE; Category: Diode; Mouser Description: Diode: Schottky rectifying; SMD; 40V; 5A; SMC; Package: reel, tape; ComponentLink2Description: Datasheet; Temperature Range High: +150°C; Automotive: No; Footprint Url: https://www.diodes.com/assets/Package-Files/SMC.pdf; Device Class L3: Schottky Diodes; Height: 2.5mm; Forward Current: 5A; Temperature: -55°C to +150°C; Package: SMC; ComponentLink2URL: https://www.diodes.com/assets/Datasheets/ds13012.pdf; Device Class L2: Diodes; Max Repetitive Reverse Voltage: 40V; Device Class L1: Discrete Semiconductors; Capacitance: 300pF
L3 = CMP-0227-00708-1: SMD-Shielded Power Inductor WE-PD, L = 10.0 µH; Inductance: 10.0 ÂµH; ComponentLink2Description: Datasheet; DatasheetVersion: ver 7, Sep-2006; PackageVersion: 2006; ComponentLink1URL: http://www.we-online.com; ComponentLink1Description: Manufacturer Link; ComponentLink2URL: http://www.we-online.de/katalog/media/pdf/74477110.pdf; PackageDescription: SMD Inductor, 2-Leads, Body 12.0 x 12.0 mm; PackageReference: WE-PD-L
R15-R19 = CMP-009-00002-14: Resistor
  R15 R16: Value: 100k
  R17 R18: Value: 1k
  R19: Value: 10k
R20 = CMP-2000-00869-1: Manufacturer: Panasonic; Part Number: ERT-J1VR103J
U3 = CMP-0069-00190-3: SIMPLE SWITCHER® High Efficiency 5A Step-Down Voltage Regulator, 7-pin TO-263; Manufacturer: Texas Instruments; PowerWise: N; PackageTopMarking: NSUZXYTTE#*LM2678*S-5.0; RoHS: N; PinCount: 7; Code_JEDEC: MO-169-AC; ComponentLink1URL: http://www.ti.com/general/docs/lit/getliterature.tsp?genericPartNumber=LM2678&fileType=pdf; ComponentLink1Description: Datasheet URL; PackageReference: KTW0007B; PackageDescription: TO-263, Molded, .400 x .390 x .180in Body, 7 Lead, .050in Pitch, Surface Mount; CompType: Switcher

## Sheet JETSON_RAW_PWR_FILTER.SchDoc
size A; SheetNumber: 13; SheetTotal: 13
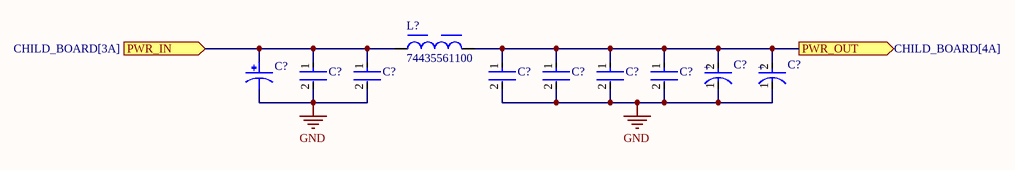
[diagram p5: JETSON_RAW_PWR_FILTER.SchDoc]

### Parts
(Parts that share a designator on the sheet are numbered #1, #2 ... from top to bottom, then left to right.)
C?#1  CGA9P3X7S2A156M250KB  [FP-CGA9P-IPC_B]  (value not drawn)
C?#2  CGA9P3X7S2A156M250KB  [FP-CGA9P-IPC_B]  (value not drawn)
C?#3  12103D106KAT2A  [FP-1210-L_3_3_0_4-W_2_5_0-MFG]  (value not drawn)
C?#4  12103D106KAT2A  [FP-1210-L_3_3_0_4-W_2_5_0-MFG]  (value not drawn)
C?#5  12103D106KAT2A  [FP-1210-L_3_3_0_4-W_2_5_0-MFG]  (value not drawn)
C?#6  12103D106KAT2A  [FP-1210-L_3_3_0_4-W_2_5_0-MFG]  (value not drawn)
C?#7  T491X107K025AT  [FP-T491X107K025AT-MFG]  (value not drawn)
C?#8  T491X107K025AT  [FP-T491X107K025AT-MFG]  (value not drawn)
C?#9  MAL215099913E3  [MAL215099913E3-Footprint-1]  (value not drawn)
L?  74435561100  [WE-HCI_1890]

### Ports
PWR_IN (in, see CHILD_BOARD[3A]), PWR_OUT (out, see CHILD_BOARD[4A])

### Nets
GND: C?#1.2 C?#2.2 C?#3.2 C?#4.2 C?#5.2 C?#6.2 C?#7.1(C) C?#8.1(C) C?#9.2
JETSON_VCC: C?#3.1 C?#4.1 C?#5.1 C?#6.1 C?#7.2(A) C?#8.2(A) L?.2 ; port PWR_OUT
NetC?#1_1: C?#1.1 C?#2.1 C?#9.1 L?.1 ; port PWR_IN

### Notes on the sheet
- (in symbol CMP-2000-07204-2) +

### Library data of the parts
C?#1 C?#2 = CMP-2000-07446-2: Cap Ceramic 15uF 100V X7S 20% Pad SMD 2220 +125°C Automotive T/R; Thickness: 0.098inch; Weight: 0.016932oz; Depth: 5mm; Min Operating Temperature: -55°C; Composition: Ceramic; Voltage Rating: 100V; Capacitance: 15uF; Package Quantity: 1; Width: 0.197inch; Max Operating Temperature: 125°C; Voltage Rating (DC): 100V; Case Code (Metric): 5750; Tolerance: 20%; Length: 5.7mm; Height: 2.3mm; Mount: Surface Mount; Dielectric: X7S; Termination: SMD/SMT; Case/Package: 2220; Case Code (Imperial): 2220; Packaging: Tape and Reel; Lead Free: Lead Free; Ratings: AEC-Q200; REACH SVHC: No SVHC
C?#3-C?#6 = CMP-2000-05477-2: General Purpose Ceramic Capacitor, 1210, 10uF, 10%, X5R, 15%, 25V; Lead Free: Lead Free; Max Operating Temperature: 85°C; REACH SVHC: No SVHC; Depth: 2.5mm; Packaging: Tape and Reel; Min Operating Temperature: -55°C; Height: 2.29mm; Construction: Flat; Case Code (Imperial): 1210; Radiation Hardening: No; Voltage: 25V; Case/Package: 1210; Series: -; Dielectric: X5R; Length: 3.2mm; Thickness: 0.11inch; Package Quantity: 1; Termination: SMD/SMT; Case Code (Metric): 3225; Voltage Rating (DC): 25V; Voltage Rating: 25V; Contact Plating: Tin; RoHS Compliant: Yes; Mount: Surface Mount; Width: 0.098inch; Capacitance: 10uF; Tolerance: 10%
C?#7 C?#8 = CMP-2000-07204-2: CAP TANT 100UF 10% 25V 2917; Leakage Current: 25uA; Ripple Current: 742mA; Polarity: Polar; Dissipation Factor: 8%; Life (Hours): 2000Hour; Dielectric Material: Tantalum; ESR (Equivalent Series Resistance): 300mR; Length: 7.3mm; RoHS Compliant: No; Failure Rate: 0.001%; REACH SVHC: No SVHC; Tolerance: 10%; Mount: Surface Mount; Height - Seated (Max): 0.169inch; Features: General Purpose; Height: 4mm; Package Quantity: 1; Case Code (Metric): 7343; Max Operating Temperature: 125°C; Number of Pins: 2; Radiation Hardening: No; Lead Free: Lead Free; Capacitance: 100uF; Termination: SMD/SMT; Voltage Rating: 25V; Series: T491; Depth: 4.3mm; Construction: Flat; Case/Package: 2917; Min Operating Temperature: -55°C; Voltage Rating (DC): 25V; Width: 4.3mm; Packaging: Tape and Reel; Case Code (Imperial): 2917; Voltage: 25V
C?#9 = CMP-001-00064-1: Aluminum Electrolytic Capacitor, Polarized, Aluminum (wet), 100V, 20% +Tol, 20% -Tol, 470uF, Surface Mount, 7171; Value: 470µF; Capacitor Type: Aluminium; RoHS Compliant: Yes; Case/Package: 7171; Pins: 2; Max Operating Temperature: 105°C; Min Operating Temperature: -40°C
L? = CMP-0226-00001-2: NexarPartId: 22803350; Inductance Tolerance: 20%; DC Resistance (DCR): 6.9mΩ; Inductance: 10µH; Saturation Current: 10A; Self Resonant Frequency: 14MHz; Width: 18.2mm; Packaging: Cut Tape (CT); Max Operating Temperature: 150°C; Number of Pins: 2; Length: 18.3mm; Min Operating Temperature: -40°C; RoHS: Compliant; Ambient Temperature Range Low: -40°C; Ambient Temperature Range High: 100°C; Height: 8.9mm

## Sheet 2V_REG.SchDoc
size A4; SheetNumber: 2; SheetTotal: 12
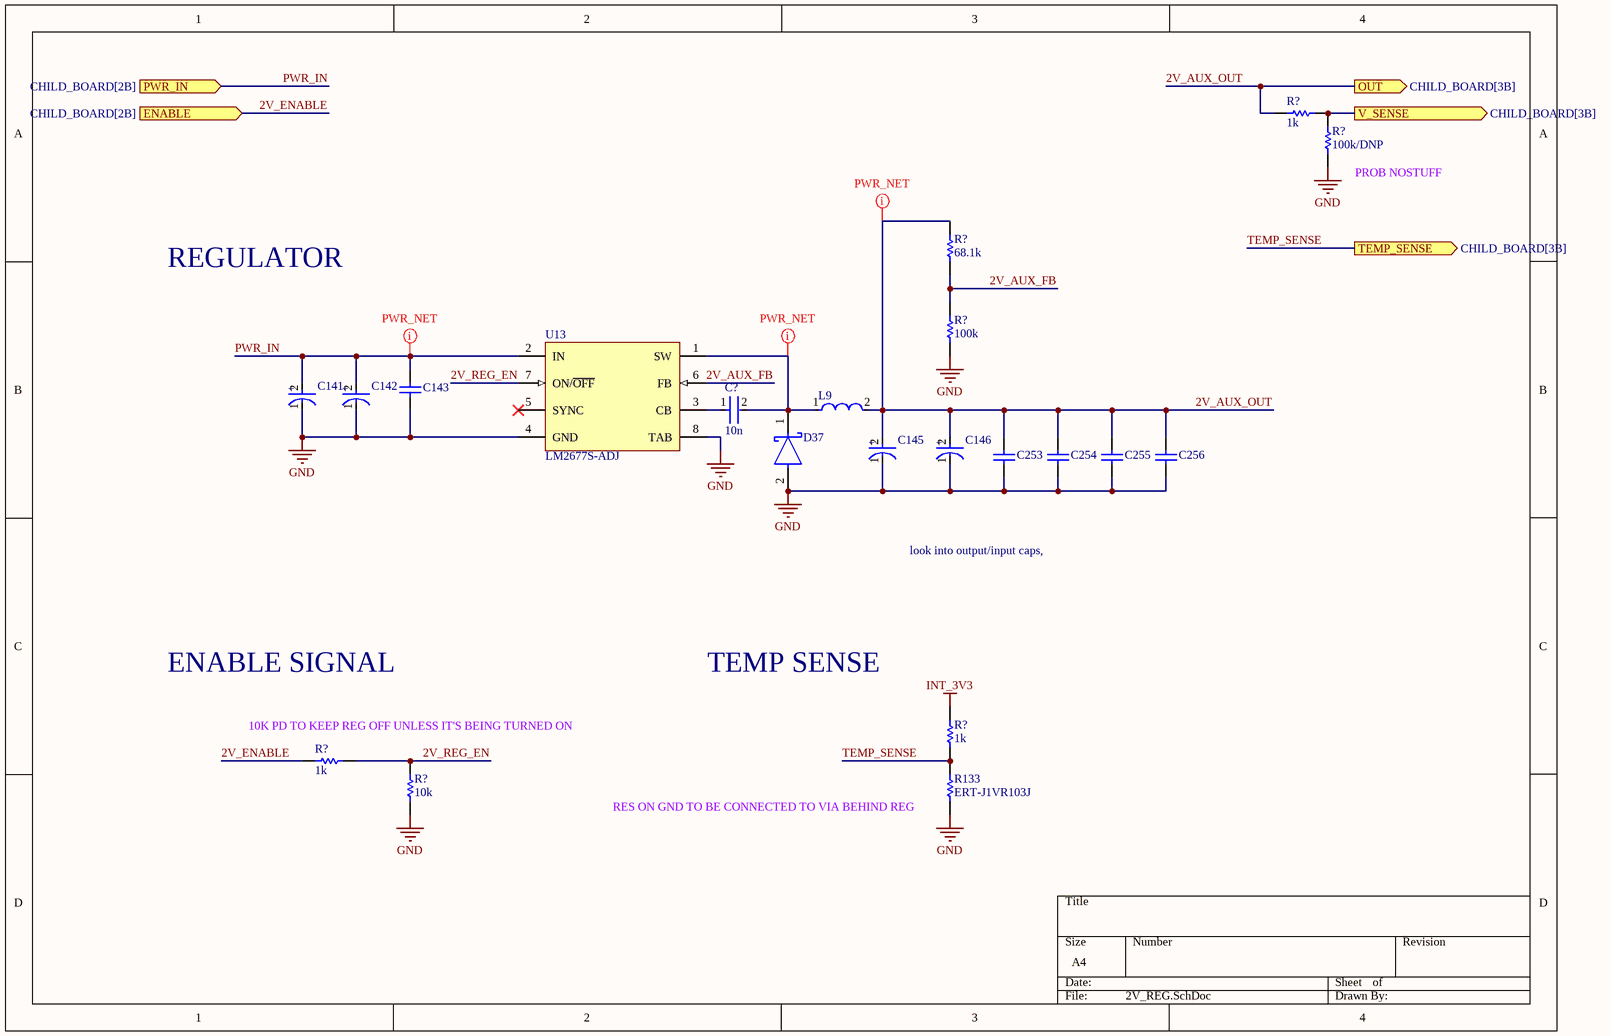
[diagram p6: 2V_REG.SchDoc]

### Parts
(Parts that share a designator on the sheet are numbered #1, #2 ... from top to bottom, then left to right.)
C141  EEHZA1V680XP  [FP-EEH-D8-MFG]  (value not drawn)
C142  EEHZA1V680XP  [FP-EEH-D8-MFG]  (value not drawn)
C143  CAP 470nF 50V 1812(4532)  [CAPC1812(4532)125_M]  (value not drawn)
C145  16SVPC120M  [FP-OS-CON-SMT-E7-MFG]  (value not drawn)
C146  16SVPC120M  [FP-OS-CON-SMT-E7-MFG]  (value not drawn)
C253  CAP 470nF 50V 1812(4532)  [CAPC1812(4532)125_M]  (value not drawn)
C254  CAP 470nF 50V 1812(4532)  [CAPC1812(4532)125_M]  (value not drawn)
C255  CAP 470nF 50V 1812(4532)  [CAPC1812(4532)125_M]  (value not drawn)
C256  CAP 470nF 50V 1812(4532)  [CAPC1812(4532)125_M]  (value not drawn)
C?#10  10n  [FP-0402-L_1_0_0_05-W_0_5-IPC_A]
D37  B540C-13-F  [FP-SMC-MFG]  (value not drawn)
L9  SRR1260-150M  [FP-SRR1260-MFG]  (value not drawn)
R133  ERT-J1VR103J  [RESC1608X90X30ML15T20]
R?#3  1k  [R0603B]
R?#4  100k/DNP  [R0603B]
R?#5  68.1k  [R0603B]
R?#6  100k  [R0603B]
R?#7  1k  [R0603B]
R?#8  1k  [R0603B]
R?#9  10k  [R0603B]
U13  LM2677S-ADJ  [KTW0007B_M]

### Ports
ENABLE (in, see CHILD_BOARD[2B]), OUT (out, see CHILD_BOARD[3B]), PWR_IN (in, see CHILD_BOARD[2B]), TEMP_SENSE (out, see CHILD_BOARD[3B]), V_SENSE (out, see CHILD_BOARD[3B])

### Nets
2V_AUX_OUT: C145.2(A) C146.2(A) C253.2 C254.2 C255.2 C256.2 L9.2 R?#3.1 R?#5.1 ; port OUT
GND: C141.1(C) C142.1(C) C143.1 C145.1(C) C146.1(C) C253.1 C254.1 C255.1 C256.1 D37.2(A) R133.1 R?#4.2 R?#6.2 R?#9.2 U13.4(GND) U13.8(TAB)
INT_3V3: R?#7.2
2V_AUX_FB: R?#5.2 R?#6.1 U13.6(FB)
2V_ENABLE: R?#8.1 ; port ENABLE  [project net 2V_AUX_ENABLE]
2V_REG_EN: R?#8.2 R?#9.1 U13.7(ON/~{OFF})
PWR_IN: C141.2(A) C142.2(A) C143.2 U13.2(IN) ; port PWR_IN
TEMP_SENSE: R133.2 R?#7.1 ; port TEMP_SENSE
NetC?#10_1: C?#10.1 U13.3(CB)
NetC?#10_2: C?#10.2 D37.1(C) L9.1 U13.1(SW)
NetR?#3_2: R?#3.2 R?#4.1 ; port V_SENSE

Not connected (* = marked no-connect by the designer): U13 5(SYNC)*

### Layout directives
net class PWR: 2V_AUX_OUT, NetC?#10_2, PWR_IN

### Notes on the sheet
- (near R?#4) PROB NOSTUFF
- REGULATOR
- look into output/input caps,
- ENABLE SIGNAL
- TEMP SENSE
- (near R?#8) 10K PD TO KEEP REG OFF UNLESS IT'S BEING TURNED ON
- RES ON GND TO BE CONNECTED TO VIA BEHIND REG
- (in symbol CMP-05428-000021-2) +
- (in symbol CMP-05428-001211-1) +

### Library data of the parts
C141 C142 = CMP-05428-001211-1: Conductive Polymer Hybrid Aluminum Electrolytic Capacitors 68uF ±20% 35V RADIAL SMT 6.3x7.7mm; Leakage Current: 23.8uA; Ripple Current (AC): 2A; Polarity: Polar; Life (Hours): 5000Hour; ESR (Equivalent Series Resistance): 35mR; Lead Diameter: 0.65mm; Termination: SMD/SMT; Case/Package: Radial; Package Quantity: 900; Radiation Hardening: No; Max Operating Temperature: 105°C; Capacitance: 68uF; Voltage Rating: 35V; Number of Pins: 8; Mount: Surface Mount; Technology: HYBRID; Diameter: 6.3mm; Min Operating Temperature: -55°C; Length: 7.7mm; Ratings: AEC-Q200; Height - Seated (Max): 0.315inch; Ripple Current: 2A; Lead Free: Lead Free; Voltage: 35V; Lead Pitch: 1.8mm; Voltage Rating (DC): 35V; REACH SVHC: No SVHC; Material: Polymer; Height: 7.7mm; Tolerance: 20%; Construction: Cylindrical; Packaging: Tape and Reel; Series: ZA
C143 C253-C256 = CMP-1040-01539-1: CAP 470nF 50V ±10% 1812 (4532 Metric) Thickness 1.25mm SMD; Tolerance: Â±10%; Case-Metric: 4532; Case-EIA: 1812; Technology: SMT; Max Thickness: 1.25 mm; Value: 470nF; Rated Voltage: 50 V
C145 C146 = CMP-05428-000021-2: Conductive Polymer Aluminum Solid Capacitors (OS-CON) 120uF ±20% 16V RADIAL SMT 8x6.9mm; Leakage Current: 500uA; Ripple Current: 2.9A; ESR (Equivalent Series Resistance): 27mR; Polarity: Polar; Dissipation Factor: 12%; Life (Hours): 2000Hour; Lead Free: Lead Free; Voltage Rating (DC): 16V; Min Operating Temperature: -55°C; Height - Seated (Max): 0.276inch; Case/Package: Radial; REACH SVHC: No SVHC; Diameter: 8mm; Mount: Surface Mount; Package Quantity: 1000; Construction: Cylindrical; Max Operating Temperature: 105°C; Capacitance: 120uF; Voltage: 16V; Length: 6.9mm; Tolerance: 20%; RoHS Compliant: Yes; Series: OS-CON, SVPC; Packaging: Tape and Reel; Voltage Rating: 16V; Termination: SMD/SMT; Number of Pins: 7; Ripple Current (AC): 2.9A; Height: 6.9mm
C?#10 = CMP-001-00058-1: as C8 on sheet TCAN1146_PWR_MGMT; Min Operating Temperature: -55°C; Mounting Technology: Surface Mount; Pins: 2; Case/Package: 0402; RoHS Compliant: Yes; Max Operating Temperature: 85°C
D37 = CMP-2000-05097-3: as D3 on sheet 5V_REG; Digikey Description: DIODE SCHOTTKY 40V 5A SMC; Temperature Range Low: -55°C; Manufacturer Part Number: B540C-13-F; Octopart: https://octopart.com/b540c-13-f-diodes+inc.-325873; Lead Free: Yes; Reverse Voltage: 40V; RoHS: TRUE; Category: Diode; Mouser Description: Diode: Schottky rectifying; SMD; 40V; 5A; SMC; Package: reel, tape; ComponentLink2Description: Datasheet; Temperature Range High: +150°C; Automotive: No; Footprint Url: https://www.diodes.com/assets/Package-Files/SMC.pdf; Device Class L3: Schottky Diodes; Height: 2.5mm; Forward Current: 5A; Temperature: -55°C to +150°C; Package: SMC; ComponentLink2URL: https://www.diodes.com/assets/Datasheets/ds13012.pdf; Device Class L2: Diodes; Max Repetitive Reverse Voltage: 40V; Device Class L1: Discrete Semiconductors; Capacitance: 300pF
L9 = CMP-2000-07146-2: FIXED IND 15UH 5A 27 MOHM SMD; Q Factor: 25; Sample Rate (Hz): 100kHz; Resistance: 27MR; Material: Steel; Inductance Tolerance: 20%; Frequency: 17.6MHz; Saturation Current: 4.6A; Core Material: Ferrite; Shielding: Shielded; Series: SRR1260; Termination: SMD/SMT; Packaging: Tape and Reel; RoHS Compliant: Yes; Height - Seated (Max): 0.256inch; Depth: 12.8mm; Case/Package: 1260; Inductance: 15uH; Height: 6mm; Number of Pins: 2; Mount: Surface Mount; Min Operating Temperature: -40°C; Test Frequency: 100kHz; Length: 12.5mm; Self Resonant Frequency: 17.6MHz; Current Rating: 5A; Tolerance: 20%; RMS Current (Irms): 5A; REACH SVHC: No SVHC; Resistor Type: Wirewound; DC Resistance (DCR): 27mR; Width: 12.5mm; Package Quantity: 600; DC Current: 5A; Max DC Current: 5A; Max Operating Temperature: 125°C; Military Standard: Not
R133 = CMP-2000-00869-1: Manufacturer: Panasonic; Part Number: ERT-J1VR103J
R?#3 R?#5-R?#9 = CMP-009-00002-14: Resistor
  R?#3 R?#7 R?#8: Value: 1k
  R?#5: Value: 68.1k
  R?#6: Value: 100k
  R?#9: Value: 10k
R?#4 = CMP-009-00002-14: Resistor; Value: 100k
U13 = CMP-0069-00211-3: SIMPLE SWITCHER® High Efficiency 5A Step-Down Voltage Regulator with Sync, 7-pin TO-263; Manufacturer: Texas Instruments; PackageTopMarking: NSUZXYTTE#*LM2677S*-ADJ; PowerWise: N; PinCount: 7; CompType: Switcher; ComponentLink1Description: Datasheet URL; PackageReference: KTW0007B; Code_JEDEC: MO-169-AC; ComponentLink1URL: http://www.ti.com/general/docs/lit/getliterature.tsp?genericPartNumber=LM2677&fileType=pdf; PackageDescription: TO-263, Molded, .400 x .390 x .180in Body, 7 Lead, .050in Pitch, Surface Mount; RoHS: N

## Sheet INT_REG.SchDoc
size A4; SheetNumber: 9; SheetTotal: 12
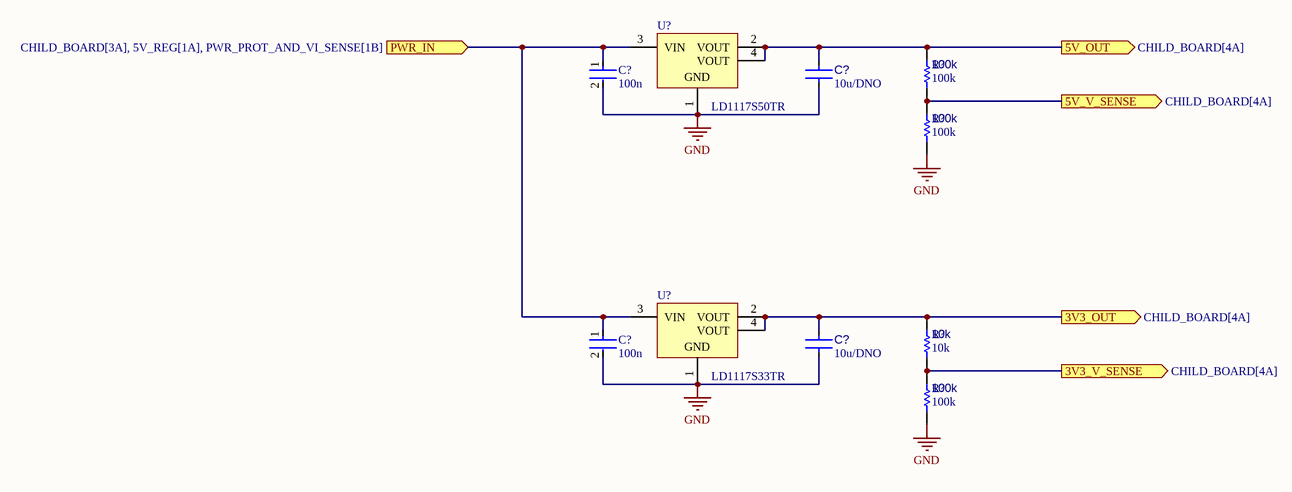
[diagram p7: INT_REG.SchDoc]

### Parts
(Parts that share a designator on the sheet are numbered #1, #2 ... from top to bottom, then left to right.)
C?#11  100n  [FP-0402-L_1_0_0_05-W_0_5-IPC_A]
C?#12  10u/DNO  [C0805A]
C?#13  100n  [FP-0402-L_1_0_0_05-W_0_5-IPC_A]
C?#14  10u/DNO  [C0805A]
R?#10  100k  [R0603B]
R?#11  100k  [R0603B]
R?#12  10k  [R0603B]
R?#13  100k  [R0603B]
U?#1  LD1117S50TR  [SOT-223_L]
U?#2  LD1117S33TR  [SOT-223_L]

### Ports
3V3_OUT (out, see CHILD_BOARD[4A]), 3V3_V_SENSE (out, see CHILD_BOARD[4A]), 5V_OUT (out, see CHILD_BOARD[4A]), 5V_V_SENSE (out, see CHILD_BOARD[4A]), PWR_IN (in, see CHILD_BOARD[3A], 5V_REG[1A], PWR_PROT_AND_VI_SENSE[1B])

### Nets
3V3_INT: C?#14.1 R?#12.1 U?#2.2(VOUT) U?#2.4(VOUT) ; port 3V3_OUT
5V0_INT: C?#12.1 R?#10.1 U?#1.2(VOUT) U?#1.4(VOUT) ; port 5V_OUT
GND: C?#11.2 C?#12.2 C?#13.2 C?#14.2 R?#11.2 R?#13.2 U?#1.1(GND) U?#2.1(GND)
PWR_OUT: C?#11.1 C?#13.1 U?#1.3(VIN) U?#2.3(VIN) ; port PWR_IN
3V3_3V3_V_SENSE: R?#12.2 R?#13.1 ; port 3V3_V_SENSE
3V3_5V_V_SENSE: R?#10.2 R?#11.1 ; port 5V_V_SENSE

### Library data of the parts
C?#11 C?#13 = CMP-001-00058-1: as C8 on sheet TCAN1146_PWR_MGMT; Min Operating Temperature: -55°C; Mounting Technology: Surface Mount; Pins: 2; Case/Package: 0402; RoHS Compliant: Yes; Max Operating Temperature: 85°C
C?#12 C?#14 = CMP-001-00000-11: Non-polarized capacitor
R?#10-R?#13 = CMP-009-00002-14: Resistor
  R?#10 R?#11 R?#13: Value: 100k
  R?#12: Value: 10k
U?#1 = CMP-0244-00312-1: Fixed Low Drop Positive Voltage Regulator, 5V, 4-Pin SOT-223, Tape and Reel; ComponentLink1URL: http://www.st.com; DatasheetVersion: 1/11/2011; PackageDescription: 4-Pin SOT-223 Package, 6.5 x 3.5 mm Body, 2.3 mm Pitch, 7 mm Lead Span; ComponentLink2URL: http://www.st.com/internet/com/TECHNICAL_RESOURCES/TECHNICAL_LITERATURE/DATASHEET/CD00000544.pdf; ComponentLink1Description: Manufacturer URL; PackageReference: SOT-223; PackageVersion: 2010; ComponentLink2Description: Datasheet
U?#2 = CMP-0244-00310-1: Fixed Low Drop Positive Voltage Regulator, 3.3V, 4-Pin SOT-223, Tape and Reel; ComponentLink2Description: Datasheet; PackageDescription: 4-Pin SOT-223 Package, 6.5 x 3.5 mm Body, 2.3 mm Pitch, 7 mm Lead Span; PackageVersion: 2010; ComponentLink2URL: http://www.st.com/internet/com/TECHNICAL_RESOURCES/TECHNICAL_LITERATURE/DATASHEET/CD00000544.pdf; PackageReference: SOT-223; DatasheetVersion: 1/11/2011; ComponentLink1Description: Manufacturer URL; ComponentLink1URL: http://www.st.com

## Sheet ADC.SchDoc
size A4; SheetNumber: 6; SheetTotal: 12
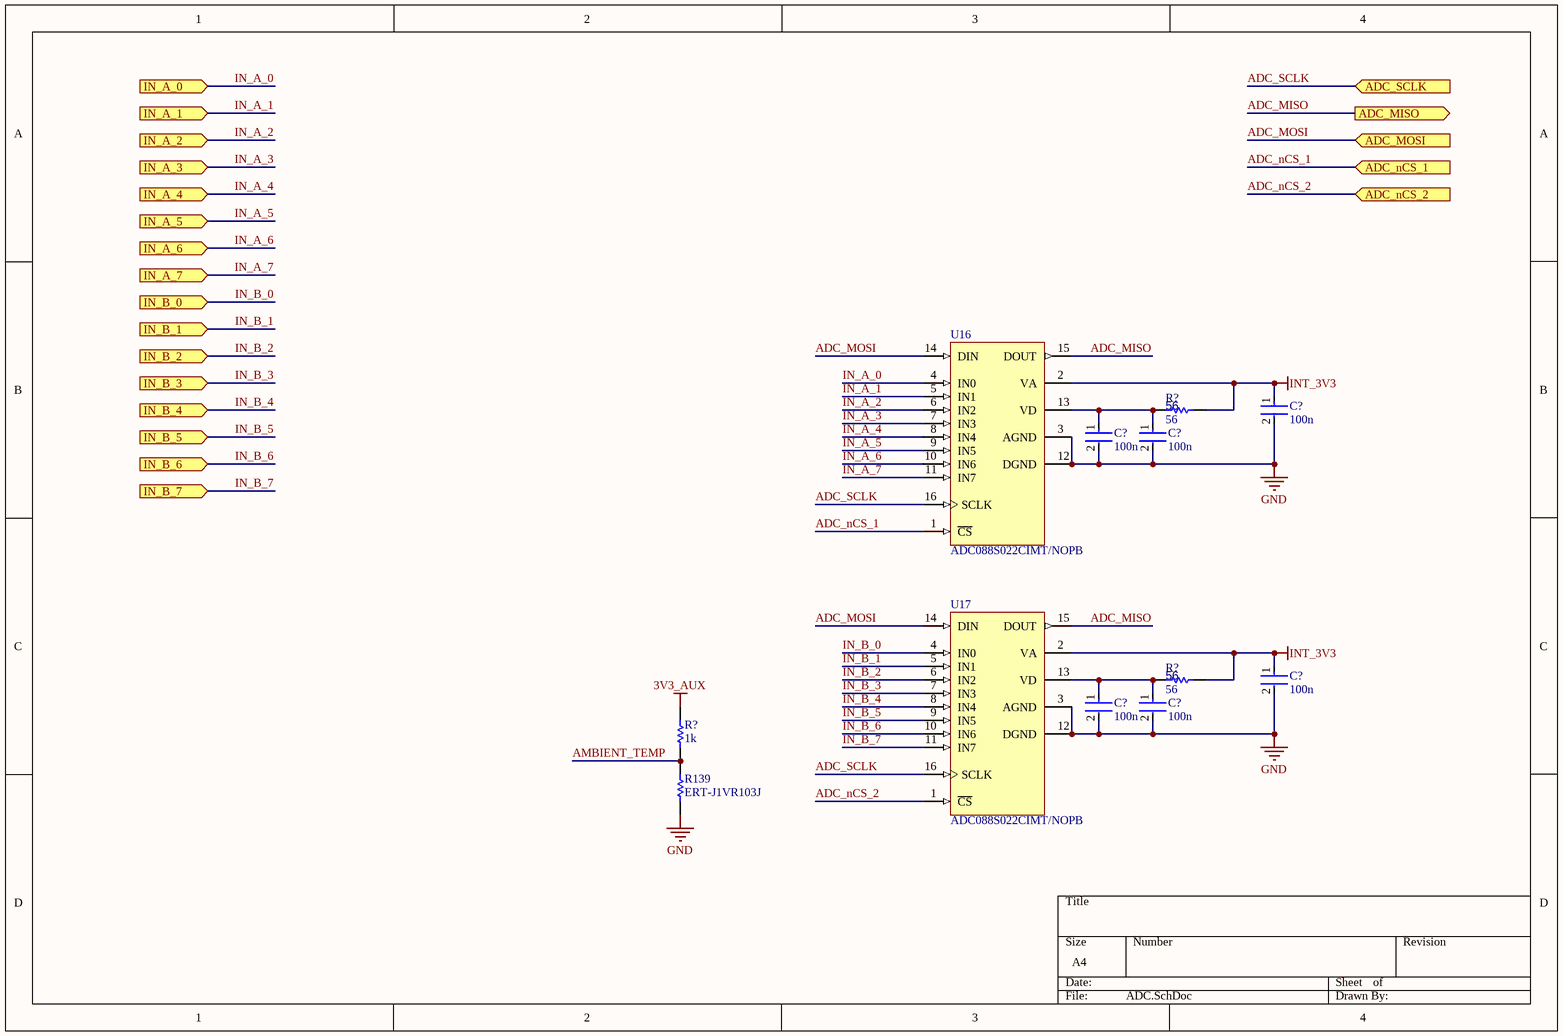
[diagram p8: ADC.SchDoc]

### Parts
(Parts that share a designator on the sheet are numbered #1, #2 ... from top to bottom, then left to right.)
C?#15  100n  [FP-0402-L_1_0_0_05-W_0_5-IPC_A]
C?#16  100n  [FP-0402-L_1_0_0_05-W_0_5-IPC_A]
C?#17  100n  [FP-0402-L_1_0_0_05-W_0_5-IPC_A]
C?#18  100n  [FP-0402-L_1_0_0_05-W_0_5-IPC_A]
C?#19  100n  [FP-0402-L_1_0_0_05-W_0_5-IPC_A]
C?#20  100n  [FP-0402-L_1_0_0_05-W_0_5-IPC_A]
R139  ERT-J1VR103J  [RESC1608X90X30ML15T20]
R?#14  56  [R0603B]
R?#15  56  [R0603B]
R?#16  1k  [R0603B]
U16  ADC088S022CIMT/NOPB  [MTC16_L]
U17  ADC088S022CIMT/NOPB  [MTC16_L]

### Ports
ADC_MISO (out, see CHILD_BOARD[3A]), ADC_MOSI (in, see CHILD_BOARD[3A]), ADC_nCS_1 (in, see CHILD_BOARD[3A]), ADC_nCS_2 (in, see CHILD_BOARD[3A]), ADC_SCLK (in, see CHILD_BOARD[3A]), IN_A_0 (in), IN_A_1 (in), IN_A_2 (in), IN_A_3 (in), IN_A_4 (in), IN_A_5 (in), IN_A_6 (in), IN_A_7 (in), IN_B_0 (in), IN_B_1 (in), IN_B_2 (in), IN_B_3 (in), IN_B_4 (in), IN_B_5 (in), IN_B_6 (in), IN_B_7 (in)

### Nets
3V3_AUX: R?#16.2
GND: C?#15.2 C?#16.2 C?#17.2 C?#18.2 C?#19.2 C?#20.2 R139.1 U16.3(AGND) U16.12(DGND) U17.3(AGND) U17.12(DGND)
INT_3V3: C?#15.1 C?#18.1 R?#14.1 R?#15.1 U16.2(VA) U17.2(VA)
ADC_MISO: U16.15(DOUT) U17.15(DOUT) ; port ADC_MISO
ADC_MOSI: U16.14(DIN) U17.14(DIN) ; port ADC_MOSI
ADC_nCS_1: U16.1(~{CS}) ; port ADC_nCS_1
ADC_nCS_2: U17.1(~{CS}) ; port ADC_nCS_2
ADC_SCLK: U16.16(SCLK) U17.16(SCLK) ; port ADC_SCLK
AMBIENT_TEMP: R139.2 R?#16.1
IN_A_0: U16.4(IN0) ; port IN_A_0
IN_A_1: U16.5(IN1) ; port IN_A_1
IN_A_2: U16.6(IN2) ; port IN_A_2
IN_A_3: U16.7(IN3) ; port IN_A_3
IN_A_4: U16.8(IN4) ; port IN_A_4
IN_A_5: U16.9(IN5) ; port IN_A_5
IN_A_6: U16.10(IN6) ; port IN_A_6
IN_A_7: U16.11(IN7) ; port IN_A_7
IN_B_0: U17.4(IN0) ; port IN_B_0
IN_B_1: U17.5(IN1) ; port IN_B_1
IN_B_2: U17.6(IN2) ; port IN_B_2
IN_B_3: U17.7(IN3) ; port IN_B_3
IN_B_4: U17.8(IN4) ; port IN_B_4
IN_B_5: U17.9(IN5) ; port IN_B_5
IN_B_6: U17.10(IN6) ; port IN_B_6
IN_B_7: U17.11(IN7) ; port IN_B_7
NetC?#16_1: C?#16.1 C?#17.1 R?#14.2 U16.13(VD)
NetC?#19_1: C?#19.1 C?#20.1 R?#15.2 U17.13(VD)

### Library data of the parts
C?#15-C?#20 = CMP-001-00058-1: as C8 on sheet TCAN1146_PWR_MGMT; Min Operating Temperature: -55°C; Mounting Technology: Surface Mount; Pins: 2; Case/Package: 0402; RoHS Compliant: Yes; Max Operating Temperature: 85°C
R139 = CMP-2000-00869-1: Manufacturer: Panasonic; Part Number: ERT-J1VR103J
R?#14-R?#16 = CMP-009-00002-14: Resistor
  R?#14 R?#15: Value: 56
  R?#16: Value: 1k
U16 U17 = CMP-0054-00372-2: 8-Channel, 50 kSPS to 200 kSPS, 8-Bit A/D Converter, 16-pin TSSOP, Pb-Free; Manufacturer: National Semiconductor; PackageTopMarking: NSUZXYTT*88S022*CIMT; CompType: ADC IC; PowerWise: Y; ComponentLink2URL: http://www.national.com/pf/AD/ADC088S022.html; RoHS: Y; PackageDescription: Molded TSSOP, Jedec, 5 x 4.4 x 0.9mm Body, 16 Lead, 0.65mm Pitch; DatasheetVersion: Feb-2010; PinCount: 16; ComponentLink1Description: ADC088S022 Datasheet; Code_JEDEC: MO-153-AB; ComponentLink3URL: http://www.national.com/packaging/folders/mtc16.html; PackageVersion: revD, Jun-2003; ComponentLink3Description: MTC16 Package Page; RevisionNote: Component URLs added; ComponentLink1URL: http://www.national.com/ds/AD/ADC088S022.pdf; ComponentLink2Description: ADC088S022 Web Page; PackageReference: MTC16